# Altium project Hardware Design.PrjPcb (part 1 of 2)
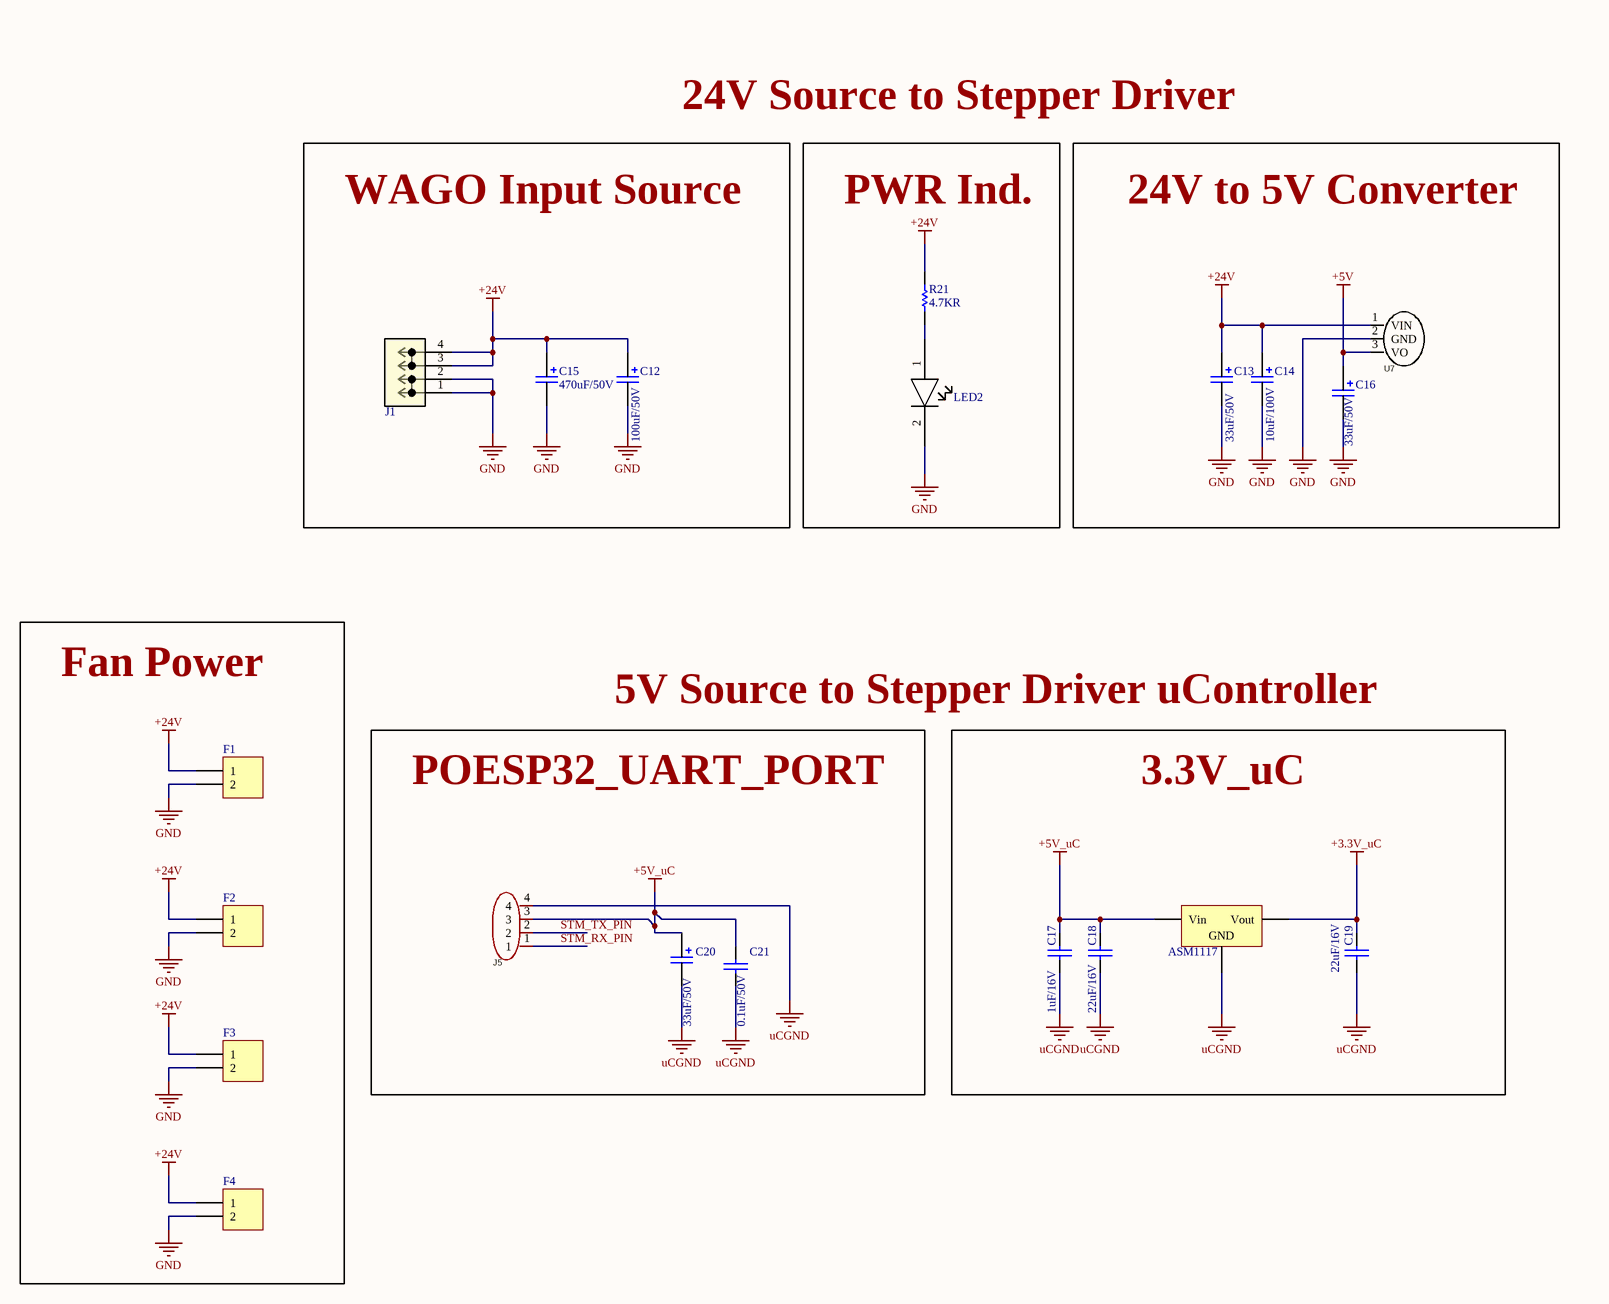
[diagram p0: POWER.SchDoc]
6 sheets, 222 parts. Net scope: global (net labels, ports and power ports of the same name join across sheets).
Board file: SystemV1.PcbDoc
Sheets:
  POWER.SchDoc
  STM.SchDoc
  Stepper Motor1.SchDoc
  Stepper Motor2.SchDoc
  Stepper Motor3.SchDoc
  Stepper Motor4.SchDoc

## Sheet POWER.SchDoc
size A2; SheetNumber: 2; SheetTotal: 7

### Parts
ASM1117  AMS1117 - 3.3V Reg  [SOT229P700X180-4N]  (value not drawn)
C12  100uF/50V  [CAPLEAD_D6.3mm]  (no BOM)
C13  33uF/50V  [CAPLEAD_D6.3mm]  (no BOM)
C14  10uF/100V  [CAPLEAD_D6.3mm]  (no BOM)
C15  470uF/50V  [CAPLEAD_D10mm]  (no BOM)
C16  33uF/50V  [CAPLEAD_D6.3mm]  (no BOM)
C17  1uF/16V  [PCBComponent_1]
C18  22uF/16V  [PCBComponent_1]
C19  22uF/16V  [PCBComponent_1]
C20  33uF/50V  [CAPLEAD_D6.3mm]  (no BOM)
C21  0.1uF/50V  [PCBComponent_1]
F1  (no value)  [PinHeader Polar]  (no BOM)
F2  (no value)  [PinHeader Polar]  (no BOM)
F3  (no value)  [PinHeader Polar]  (no BOM)
F4  (no value)  [PinHeader Polar]  (no BOM)
J1  Terminal Block  [CONN2_235-402331-000_WAGO]  (value not drawn)  (no BOM)
J5  Header 4P*2mm  [CONN-TH_4P-P2.00_HX20020-4A_2]  (value not drawn)  (no BOM)
LED2  1206 LED  [1206 LED]  (value not drawn)
R21  4.7KR  [R0402]
U7  C5369649  [SIP-3]  (value not drawn)  (no BOM)

### Blocks framed on the sheet
WAGO Input Source: C12 C15 J1
PWR Ind.: LED2 R21
24V to 5V Converter: C13 C14 C16 U7
Fan Power: F1-F4
POESP32_UART_PORT: C20 C21 J5
3.3V_uC: ASM1117 C17-C19

### Nets
+3.3V_uC: ASM1117.Vout C19.2
+5V: C16.1 U7.3(VO)
+5V_uC: ASM1117.Vin C17.2 C18.2 C20.1 C21.2 J5.3
+24V: C12.1 C13.1 C14.1 C15.1 F1.1 F2.1 F3.1 F4.1 J1.3(2_1) J1.4(2_2) R21.1 U7.1(VIN)
GND: C12.2 C13.2 C14.2 C15.2 C16.2 F1.2 F2.2 F3.2 F4.2 J1.1(1_1) J1.2(1_2) LED2.2 U7.2(GND)
uCGND: ASM1117.GND C17.1 C18.1 C19.1 C20.2 C21.1 J5.4
STM_RX_PIN: J5.1
STM_TX_PIN: J5.2
NetLED2_1: LED2.1 R21.2

### Notes on the sheet
- 24V Source to Stepper Driver
- 5V Source to Stepper Driver uController

### Library data of the parts
ASM1117 = AMS1117 - 3.3V Reg: C347222; Created By: NourAldin
C12 = A759EQ475M2AAAE160: C47891; Manufacturer: KEMET; Supplier 1: Mouser; Manufacturer Part Number: A759EQ475M2AAAE160; RoHS: Yes; Category: Polymer Capacitors; Stock 1: 17219; Pricing 1: 1=0.97, 10=0.73, 50=0.73, 100=0.546, 1000=0.384, 10000=0.326 (USD); ComponentLink1URL: http://www.kemet.com/docfinder?Partnumber=A759EQ475M2AAAE160&src-supplier=Digikey; ComponentLink1Description: http://www.kemet.com/docfinder?Partnumber=A759EQ475M2AAAE160&src-supplier=Digikey; ComponentLink2URL: http://www.farnell.com/datasheets/2095614.pdf?src-supplier=Element14; ComponentLink2Description: http://www.farnell.com/datasheets/2095614.pdf?src-supplier=Element14; Supplier Part Number 1: 80-A759EQ475M2AAE160
C13 C16 C20 = A759EQ475M2AAAE160: C45099; Manufacturer: KEMET; Supplier 1: Mouser; Manufacturer Part Number: A759EQ475M2AAAE160; RoHS: Yes; Category: Polymer Capacitors; Stock 1: 17219; Pricing 1: 1=0.97, 10=0.73, 50=0.73, 100=0.546, 1000=0.384, 10000=0.326 (USD); ComponentLink1URL: http://www.kemet.com/docfinder?Partnumber=A759EQ475M2AAAE160&src-supplier=Digikey; ComponentLink1Description: http://www.kemet.com/docfinder?Partnumber=A759EQ475M2AAAE160&src-supplier=Digikey; ComponentLink2URL: http://www.farnell.com/datasheets/2095614.pdf?src-supplier=Element14; ComponentLink2Description: http://www.farnell.com/datasheets/2095614.pdf?src-supplier=Element14; Supplier Part Number 1: 80-A759EQ475M2AAE160
C14 = A759EQ475M2AAAE160: C2029; Manufacturer: KEMET; Supplier 1: Mouser; Manufacturer Part Number: A759EQ475M2AAAE160; RoHS: Yes; Category: Polymer Capacitors; Stock 1: 17219; Pricing 1: 1=0.97, 10=0.73, 50=0.73, 100=0.546, 1000=0.384, 10000=0.326 (USD); ComponentLink1URL: http://www.kemet.com/docfinder?Partnumber=A759EQ475M2AAAE160&src-supplier=Digikey; ComponentLink1Description: http://www.kemet.com/docfinder?Partnumber=A759EQ475M2AAAE160&src-supplier=Digikey; ComponentLink2URL: http://www.farnell.com/datasheets/2095614.pdf?src-supplier=Element14; ComponentLink2Description: http://www.farnell.com/datasheets/2095614.pdf?src-supplier=Element14; Supplier Part Number 1: 80-A759EQ475M2AAE160
C15 = MAL215058101E3: C2960279; Manufacturer: Vishay BCcomponents; Manufacturer Part Number: MAL215058101E3; RoHS: Yes; Category: Aluminum Electrolytic Capacitors; Stock 1: 1562; Pricing 1: 1=1.45, 10=1.09, 50=1.09, 100=0.799, 1000=0.585, 10000=0.496 (USD); ComponentLink1URL: https://datasheet.ciiva.com/11697/150rmi-11697723.pdf?src-supplier=Avnet; ComponentLink1Description: https://datasheet.ciiva.com/11697/150rmi-11697723.pdf?src-supplier=Avnet; Supplier 1: Mouser; Supplier 2: LCSC; Supplier Part Number 2: C1596751; Supplier Part Number 1: 594-2222-150-58101
C17 = 0603 Capacitor: C1592; Created By: NourAldin; DataSheet Link: https://eu.mouser.com/datasheet/2/400/lcc_automotive_general_en-843974.pdf; Mouser Link: https://eu.mouser.com/ProductDetail/TDK/CGA1A2X7R1H331M030BA?qs=sGAEpiMZZMs0AnBnWHyRQL8L3bkL%252bvtyS9XpSB1mk7rVV5K8%252bbxEeg%3d%3d
C18 C19 = 0603 Capacitor: C2762594; Created By: NourAldin; DataSheet Link: https://eu.mouser.com/datasheet/2/400/lcc_automotive_general_en-843974.pdf; Mouser Link: https://eu.mouser.com/ProductDetail/TDK/CGA1A2X7R1H331M030BA?qs=sGAEpiMZZMs0AnBnWHyRQL8L3bkL%252bvtyS9XpSB1mk7rVV5K8%252bbxEeg%3d%3d
C21 = 0603 Capacitor: C1591; Created By: NourAldin; DataSheet Link: https://eu.mouser.com/datasheet/2/400/lcc_automotive_general_en-843974.pdf; Mouser Link: https://eu.mouser.com/ProductDetail/TDK/CGA1A2X7R1H331M030BA?qs=sGAEpiMZZMs0AnBnWHyRQL8L3bkL%252bvtyS9XpSB1mk7rVV5K8%252bbxEeg%3d%3d
F1-F4 = Header 2 pin: Created By: NourAldin
J1 = 235-402331-000: C7461083; Mfr_Name: Wago; RefDes: RefDes; Type: Type
J5 = ZX-HY2.0-4PZZ: C42372479; Manufacturer: Megastar(兆星); Add into BOM: yes; Pins Structure: 1x4P; Pitch: 2mm; Reference Series: HY; Number of PINs Per Row: 4; Current Rating (Max): 2A; Rated Voltage (Max): 250V; Flame Retardant Rating: UL94V-0; Z-Height of the Board: 8mm; X-Length of Bottom Edge on Board (Spacing Line): 10mm; Y-Width of Bottom Edge on Board: 5.1mm; Symbol: ZX-HY2.0-4PZZ; Device: ZX-HY2.0-4PZZ; LCSC Part Name: 1x4P 间距:2mm 直插 系列:HY 配套胶壳型号：ZX-HY2.0-4PJK 配套端子型号：ZX-HY2.0-DZ 配套杜邦线型号：ZX-HY2.0-4PBXC; Supplier Part: C7429580; Manufacturer Part: ZX-HY2.0-4PZZ; Supplier Footprint: 插件,P=2mm; JLCPCB Part Class: Extended Part; Datasheet: https://atta.szlcsc.com/upload/public/pdf/source/20241025/5A7CD93910E89EF197073334521200FC.pdf; Supplier: LCSC; Convert to PCB: yes; Mounting Style: Direct Insert; Number of Pins: 4P; Number of Rows: 1; Row Spacing: -; Contact Material: Brass; Contact Plating: Tin; Operating Temperature Range: -25℃~+85℃; Plastic Material: -; Supplementary Features: -; Colour: White
LED2 = 1206 LED: C434442; Created By: NourAldin
R21 = 0402 Resistor: C105871
U7 = K7805M-1000R3_C5369649: Manufacturer: YLPTEC(易川); Add into BOM: yes; Conversion Type: DC-DC; Function: Boost type; Input Voltage(DC): 7V~36V; Output Voltage: 5V; Output Power: 5W; Output Current (Max): 1000mA; Output Channel: 1; Conversion Efficiency: 94%; Maximum Capacitive Load: 2200uF; Symbol: K7805M-1000R3_C5369649; Device: K7805M-1000R3_C5369649; LCSC Part Name: K7805M-1000R3; Supplier Part: C5369649; Manufacturer Part: K7805M-1000R3; Supplier Footprint: SIP-3; JLCPCB Part Class: Extended Part; Datasheet: https://atta.szlcsc.com/upload/public/pdf/source/20230612/70568B8922D00E56BE7D7C892197C716.pdf; Supplier: LCSC; Convert to PCB: yes; Feature: Short-Circuit  Protection；Low-Power Consumption

## Sheet STM.SchDoc
size B; SheetNumber: 3; SheetTotal: 7
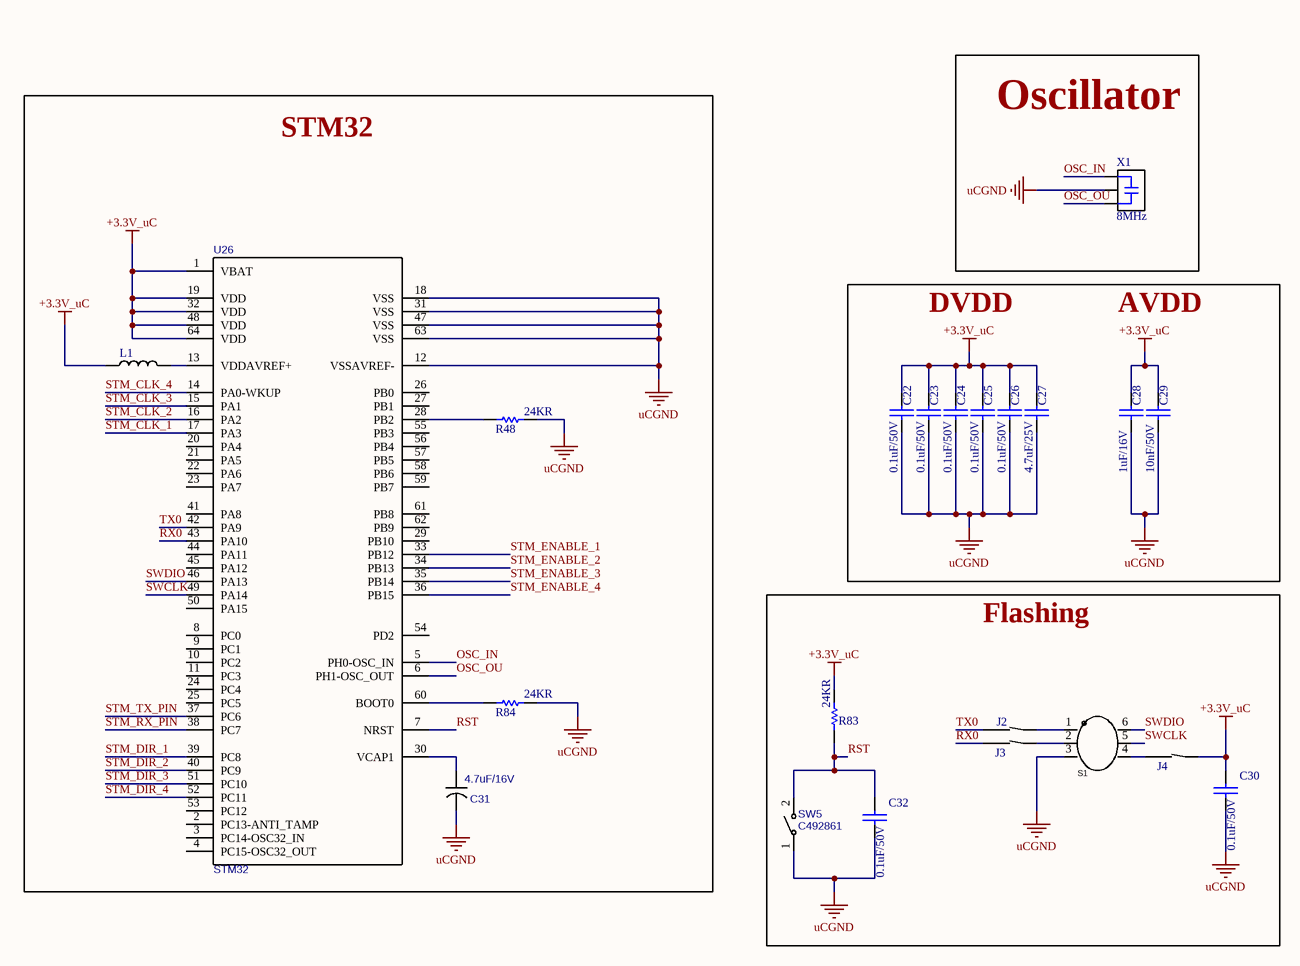
[diagram p1: STM.SchDoc]

### Parts
C22  0.1uF/50V  [PCBComponent_1]
C23  0.1uF/50V  [PCBComponent_1]
C24  0.1uF/50V  [PCBComponent_1]
C25  0.1uF/50V  [PCBComponent_1]
C26  0.1uF/50V  [PCBComponent_1]
C27  4.7uF/25V  [PCBComponent_1]
C28  1uF/16V  [PCBComponent_1]
C29  10nF/50V  [PCBComponent_1]
C30  0.1uF/50V  [PCBComponent_1]
C31  4.7uF/16V  [CASE-B_3528]
C32  0.1uF/50V  [PCBComponent_1]
J2  Jumper  [Jumper]  (value not drawn)  (no BOM)
J3  Jumper  [Jumper]  (value not drawn)  (no BOM)
J4  Jumper  [Jumper]  (value not drawn)  (no BOM)
L1  CMI201209X100KT  [INDC2012X06N]  (value not drawn)
R48  24KR  [RESC1608X06N]
R83  24KR  [RESC1608X06N]
R84  24KR  [RESC1608X06N]
S1  STM Debug  [STM_Debug]  (value not drawn)  (no BOM)
SW5  C492861  [SW-SMD_L4.0-W3.0-LS4.8]
U26  STM32  [LQFP-64_L10.0-W10.0-P0.50-LS12.0-BL]
X1  8MHz  [SMD3213-3P]

### Blocks framed on the sheet
Oscillator: X1
STM32: C31 L1 R48 R84 U26
Flashing: C30 C32 J2-J4 R83 S1 SW5

### Nets
+3.3V_uC: C22.2 C23.2 C24.2 C25.2 C26.2 C27.2 C28.2 C29.2 C30.2 J4.2 L1.1 R83.1 U26.1(VBAT) U26.19(VDD) U26.32(VDD) U26.48(VDD) U26.64(VDD)
uCGND: C22.1 C23.1 C24.1 C25.1 C26.1 C27.1 C28.1 C29.1 C30.1 C31.2 C32.1 R48.1 R84.1 S1.3 SW5.1 U26.12(VSSAVREF-) U26.18(VSS) U26.31(VSS) U26.47(VSS) U26.63(VSS) X1.2
OSC_IN: U26.5(PH0-OSC_IN) X1.1
OSC_OU: U26.6(PH1-OSC_OUT) X1.3
RST: C32.2 R83.2 SW5.2 U26.7(NRST)
RX0: J3.1 U26.43(PA10)
STM_CLK_1: U26.17(PA3)
STM_CLK_2: U26.16(PA2)
STM_CLK_3: U26.15(PA1)
STM_CLK_4: U26.14(PA0-WKUP)
STM_DIR_1: U26.39(PC8)
STM_DIR_2: U26.40(PC9)
STM_DIR_3: U26.51(PC10)
STM_DIR_4: U26.52(PC11)
STM_ENABLE_1: U26.33(PB12)
STM_ENABLE_2: U26.34(PB13)
STM_ENABLE_3: U26.35(PB14)
STM_ENABLE_4: U26.36(PB15)
STM_RX_PIN: U26.38(PC7)
STM_TX_PIN: U26.37(PC6)
SWCLK: S1.5 U26.49(PA14)
SWDIO: S1.6 U26.46(PA13)
TX0: J2.1 U26.42(PA9)
NetC31_1: C31.1 U26.30(VCAP1)
NetJ2_2: J2.2 S1.1
NetJ3_2: J3.2 S1.2
NetJ4_1: J4.1 S1.4
NetL1_2: L1.2 U26.13(VDDAVREF+)
NetR48_2: R48.2 U26.28(PB2)
NetR84_2: R84.2 U26.60(BOOT0)

Not connected (* = marked no-connect by the designer): U26 2(PC13-ANTI_TAMP) 3(PC14-OSC32_IN) 4(PC15-OSC32_OUT) 8(PC0) 9(PC1) 10(PC2) 11(PC3) 20(PA4) 21(PA5) 22(PA6) 23(PA7) 24(PC4) 25(PC5) 26(PB0) 27(PB1) 29(PB10) 41(PA8) 44(PA11) 45(PA12) 50(PA15) 53(PC12) 54(PD2) 55(PB3) 56(PB4) 57(PB5) 58(PB6) 59(PB7) 61(PB8) 62(PB9)

### Notes on the sheet
- DVDD
- AVDD

### Library data of the parts
C22-C26 C30 C32 = 0603 Capacitor: C1591; Created By: NourAldin; DataSheet Link: https://eu.mouser.com/datasheet/2/400/lcc_automotive_general_en-843974.pdf; Mouser Link: https://eu.mouser.com/ProductDetail/TDK/CGA1A2X7R1H331M030BA?qs=sGAEpiMZZMs0AnBnWHyRQL8L3bkL%252bvtyS9XpSB1mk7rVV5K8%252bbxEeg%3d%3d
C27 = 0603 Capacitor: C69335; Created By: NourAldin; DataSheet Link: https://eu.mouser.com/datasheet/2/400/lcc_automotive_general_en-843974.pdf; Mouser Link: https://eu.mouser.com/ProductDetail/TDK/CGA1A2X7R1H331M030BA?qs=sGAEpiMZZMs0AnBnWHyRQL8L3bkL%252bvtyS9XpSB1mk7rVV5K8%252bbxEeg%3d%3d
C28 = 0603 Capacitor: C1592; Created By: NourAldin; DataSheet Link: https://eu.mouser.com/datasheet/2/400/lcc_automotive_general_en-843974.pdf; Mouser Link: https://eu.mouser.com/ProductDetail/TDK/CGA1A2X7R1H331M030BA?qs=sGAEpiMZZMs0AnBnWHyRQL8L3bkL%252bvtyS9XpSB1mk7rVV5K8%252bbxEeg%3d%3d
C29 = 0603 Capacitor: C100042; Created By: NourAldin; DataSheet Link: https://eu.mouser.com/datasheet/2/400/lcc_automotive_general_en-843974.pdf; Mouser Link: https://eu.mouser.com/ProductDetail/TDK/CGA1A2X7R1H331M030BA?qs=sGAEpiMZZMs0AnBnWHyRQL8L3bkL%252bvtyS9XpSB1mk7rVV5K8%252bbxEeg%3d%3d
C31 = 3528  Tantalum Cap: C7206; Manufacturer: Kyocera AVX; Manufacturer Part: TAJR106K006RNJ; nameAlias: Value; Contributor: LCSC; Supplier: LCSC; Supplier Part: C132274; JLCPCB Part Class: Extended Part; spicePre: C; spiceSymbolName: TAJR106K006RNJ
L1 = 0805 SMD INDUCTOR: C99366; Created By: NourAldin
R48 R83 R84 = 0603 Resistor: C2930081; Created By: NourAldin; Mouser Link: https://eu.mouser.com/ProductDetail/Panasonic/ERA-3AHD180V?qs=sGAEpiMZZMvdGkrng054t5mej2KPdPuFSlDBd1tSiF0%3d; DataSheet Link: https://eu.mouser.com/datasheet/2/315/AOA0000C307-1149632.pdf
S1 = STM Debug: Wurth Elektronik 490107670612; Manufacturer: XKB Connection(中国星坤); Symbol: X4621WVS-2X03I-C40D64; Add into BOM: yes; Pin Structure: 2x3P; Pitch: 2mm; Circluar Pins/Square Pins: Square Pins; Current Rating (Max): 2A; Voltage Rating (Max): 250V; Soldering Temperature(Max): 260℃; Device: X4621WVS-2x03I-C40D64; LCSC Part Name: 2x3P 间距:2mm 方针 直插; Supplier Part: C917608; Manufacturer Part: X4621WVS-2x03I-C40D64; Supplier Footprint: SMD,P=2mm; JLCPCB Part Class: Extended Part; Datasheet: https://atta.szlcsc.com/upload/public/pdf/source/20211011/BBC0D112400A54BA7413419DECD38CC2.pdf; Supplier: LCSC; Convert to PCB: yes; Row Spacing: 2mm; Mounting Type: Straight; Number of Rows: 双排; Number of Pins: 6P; Length of Mating Pin: 4mm; Insulation Height: 2mm; Length of End Connection Pin: 6.4mm; Contact Plating: Gold; Operating Temperature Range: -40℃~+105℃; Color: Black
SW5 = tact switch: Manufacturer: Yuandi(元迪); Manufacturer Part: TS-1071AS-A1B3-D4; Contributor: LCSC; Supplier: LCSC; Supplier Part: C492861; JLCPCB Part Class: Extended Part; spicePre: S; spiceSymbolName: TS-1071AS-A1B3-D4
U26 = STM32F401RCT6: C74524; Manufacturer: ST(意法半导体); Supplier: LCSC; Manufacturer Part: STM32F401RCT6; Supplier Part: C74524; JLCPCB Part Class: Extended Part; spicePre: U; spiceSymbolName: STM32F401RCT6
X1 = CSTCE16M0V53-R0: C907975; Manufacturer: Murata; Frequency: 16MHz; Frequency Stability: 0.3%; Frequency Tolerance: 0.5%; Capacitance: 15pF; Impedance: 40R; Supplier 1: Digi-Key; Manufacturer Part Number: CSTCE16M0V53-R0; RoHS: Yes; Category: Resonators; Mount: Surface Mount; Case/Package: SMD/SMT; Min Operating Temperature: -40°C; Max Operating Temperature: 85°C; Packaging: Cut Tape; Series: CERALOCK® CSTNE; RoHS Compliant: Yes; ComponentLink1URL: https://www.murata.com/en/products/productdata/8801162231838/SPEC-CSTNE16M0V530000R0.pdf?src-supplier=Digi-Key; ComponentLink1Description: https://www.murata.com/en/products/productdata/8801162231838/SPEC-CSTNE16M0V530000R0.pdf?src-supplier=Digi-Key; LCSC Link: https://www.lcsc.com/product-detail/Ceramic-Resonators_Murata-Electronics-CSTCE16M0V53-R0_C32180.html; Supplier Part Number 1: 490-1198-2-ND; Supplier Part Number 2: C32180

## Sheet Stepper Motor1.SchDoc
size A2; SheetNumber: 4; SheetTotal: 7
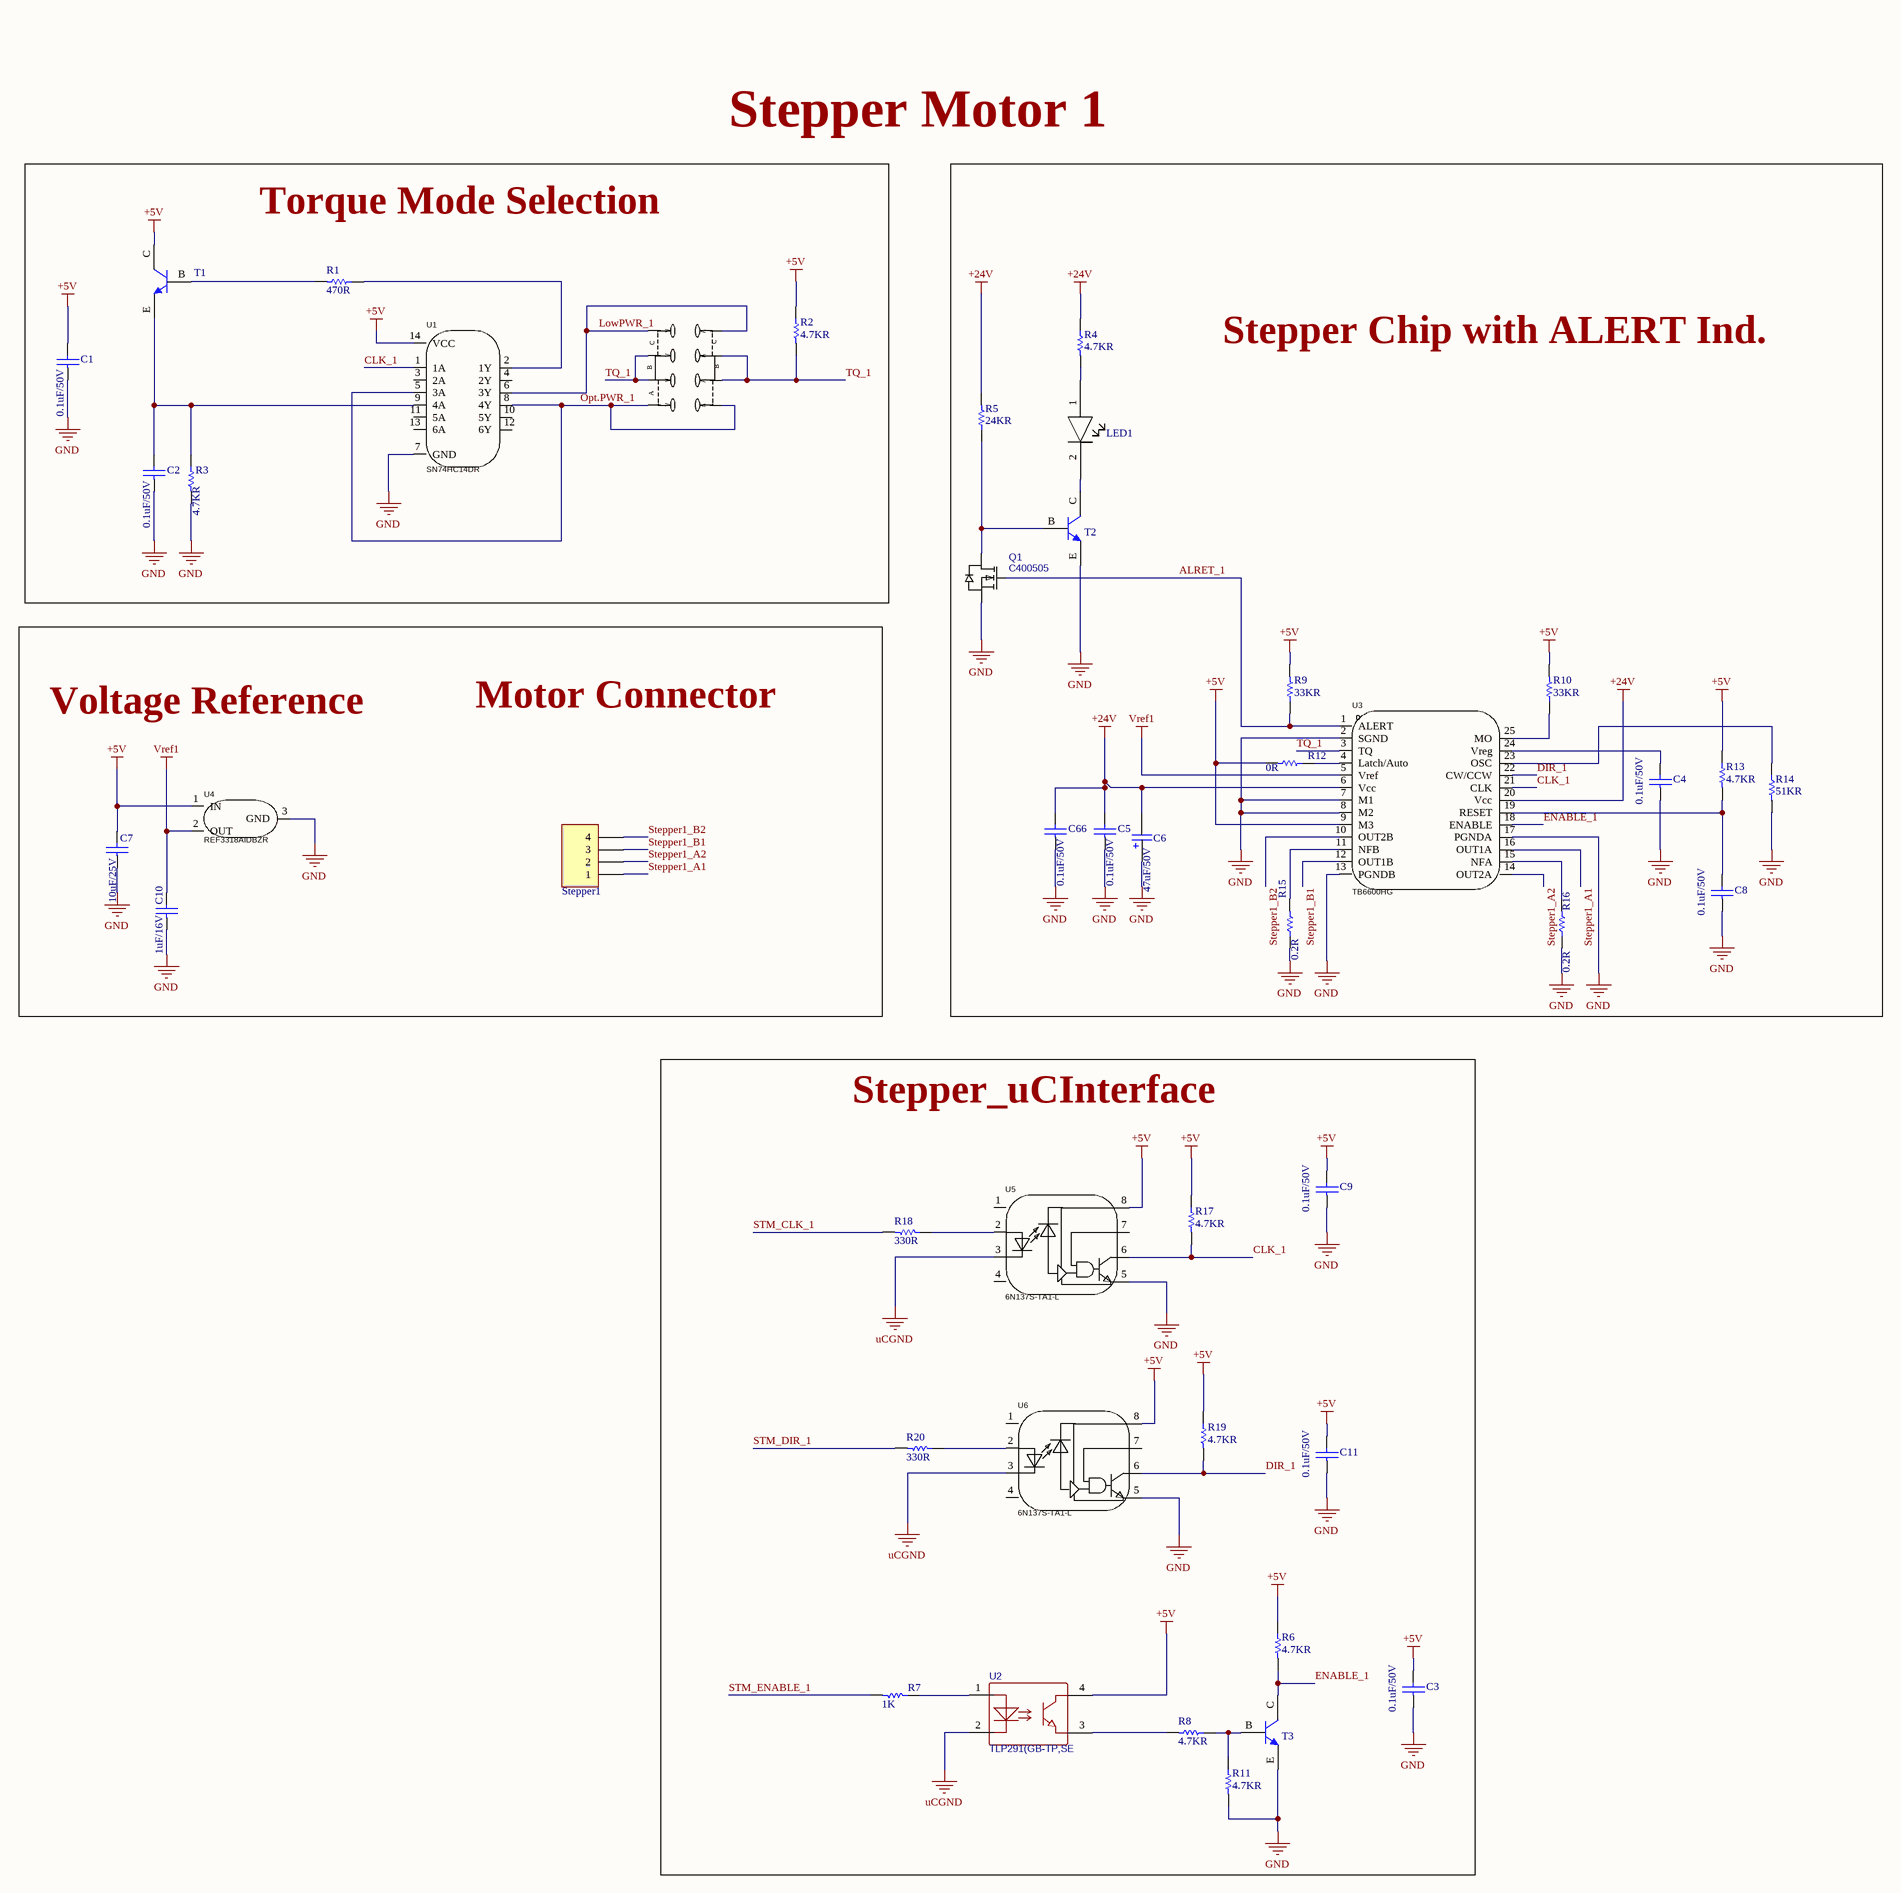
[diagram p2: Stepper Motor1.SchDoc]

### Parts
C1  0.1uF/50V  [PCBComponent_1]
C2  0.1uF/50V  [PCBComponent_1]
C3  0.1uF/50V  [PCBComponent_1]
C4  0.1uF/50V  [PCBComponent_1]
C5  0.1uF/50V  [PCBComponent_1]
C6  47uF/50V  [CAPLEAD_D6.3mm]  (no BOM)
C7  10uF/25V  [PCBComponent_1]
C8  0.1uF/50V  [PCBComponent_1]
C9  0.1uF/50V  [PCBComponent_1]
C10  1uF/16V  [PCBComponent_1]
C11  0.1uF/50V  [PCBComponent_1]
C66  0.1uF/50V  [PCBComponent_1]
LED1  1206 LED  [1206 LED]  (value not drawn)
Q1  C400505  [SOT-23-3_L2.9-W1.3-P1.90-LS2.4-BR]
R1  470R  [RESC1608X06N]
R2  4.7KR  [R0402]
R3  4.7KR  [R0402]
R4  4.7KR  [R0402]
R5  24KR  [RESC1608X06N]
R6  4.7KR  [R0402]
R7  1K  [R0402]
R8  4.7KR  [R0402]
R9  33KR  [RESC1608X06N]
R10  33KR  [RESC1608X06N]
R11  4.7KR  [R0402]
R12  0R  [RESC1608X06N]
R13  4.7KR  [R0402]
R14  51KR  [R0402]
R15  0.2R  [RESC6431X12N]
R16  0.2R  [RESC6431X12N]
R17  4.7KR  [R0402]
R18  330R  [R0402]
R19  4.7KR  [R0402]
R20  330R  [R0402]
Stepper1  Header 4 Pin Polar  [PCBComponent_1]  (value not drawn)  (no BOM)
SW1  MST23D19G2  [SW-SMD_MST23D19G2]  (value not drawn)
T1  MMBT3904 Transistor  [MMBT3904]  (value not drawn)
T2  MMBT3904 Transistor  [MMBT3904]  (value not drawn)
T3  MMBT3904 Transistor  [MMBT3904]  (value not drawn)
U1  SN74HC14DR  [SOIC-14_L8.7-W3.9-P1.27-LS6.0-BL]
U2  TLP291(GB-TP,SE  [SOP-4-1.27mm]
U3  TB6600HG  [HZIP25-P-1.00F]  (no BOM)
U4  REF3318AIDBZR  [SOT-23-3_L2.9-W1.3-P1.90-LS2.4-BR]
U5  6N137S-TA1-L  [SOP-8_L9.8-W6.6-P2.54-LS10.3-BL]
U6  6N137S-TA1-L  [SOP-8_L9.8-W6.6-P2.54-LS10.3-BL]

### Blocks framed on the sheet
Torque Mode Selection: C1 C2 R1-R3 SW1 T1 U1
Stepper Chip with ALERT Ind.: C4-C6 C8 C66 LED1 Q1 R4 R5 R9 R10 R12-R16 T2 U3
Stepper_uCInterface: C3 C9 C11 R6-R8 R11 R17-R20 T3 U2 U5 U6

### Nets
+5V: C1.2 C3.2 C7.2 C9.2 C11.2 R2.1 R6.1 R9.2 R10.2 R12.2 R13.1 R17.1 R19.1 T1.C U1.14(VCC) U2.4 U3.9(M3) U4.1(IN) U5.8 U6.8
+24V: C5.2 C6.2 C66.2 R4.1 R5.2 U3.6(Vcc) U3.20(Vcc)
GND: C1.1 C2.1 C3.1 C4.1 C5.1 C6.1 C7.1 C8.1 C9.1 C10.1 C11.1 C66.1 Q1.2(S) R3.2 R11.2 R14.2 R15.1 R16.1 T2.E T3.E U1.7(GND) U3.2(SGND) U3.7(M1) U3.8(M2) U3.13(PGNDB) U3.17(PGNDA) U4.3(GND) U5.5 U6.5
uCGND: U2.2 U5.3 U6.3
Vref1: C10.2 U3.5(Vref) U4.2(OUT)
ALRET_1: Q1.1(G) R9.1 U3.1(ALERT)
CLK_1: R17.2 U1.1(1A) U3.21(CLK) U5.6
DIR_1: R19.2 U3.22(CW/CCW) U6.6
ENABLE_1: R6.2 T3.C U3.18(ENABLE)
LowPWR_1: SW1.4 SW1.5 U1.6(3Y)
Opt.PWR_1: SW1.1 SW1.8 U1.5(3A) U1.8(4Y)
Stepper1_A1: Stepper1.1 U3.16(OUT1A)
Stepper1_A2: Stepper1.2 U3.14(OUT2A)
Stepper1_B1: Stepper1.3 U3.12(OUT1B)
Stepper1_B2: Stepper1.4 U3.10(OUT2B)
STM_CLK_1: R18.2
STM_DIR_1: R20.2
STM_ENABLE_1: R7.2
TQ_1: R2.2 SW1.2 SW1.3 SW1.6 SW1.7 U3.3(TQ)
NetC2_2: C2.2 R3.1 T1.E U1.9(4A)
NetC4_2: C4.2 U3.24(Vreg)
NetC8_2: C8.2 R13.2 U3.19(RESET)
NetLED1_1: LED1.1 R4.2
NetLED1_2: LED1.2 T2.C
NetQ1_3: Q1.3(D) R5.1 T2.B
NetR1_1: R1.1 U1.2(1Y)
NetR1_2: R1.2 T1.B
NetR7_1: R7.1 U2.1
NetR8_1: R8.1 R11.1 T3.B
NetR8_2: R8.2 U2.3
NetR10_1: R10.1 U3.25(MO)
NetR12_1: R12.1 U3.4(Latch/Auto)
NetR14_1: R14.1 U3.23(OSC)
NetR15_2: R15.2 U3.11(NFB)
NetR16_2: R16.2 U3.15(NFA)
NetR18_1: R18.1 U5.2
NetR20_1: R20.1 U6.2

Not connected (* = marked no-connect by the designer): U1 3(2A) 4(2Y) 10(5Y) 11(5A) 12(6Y) 13(6A); U5 1(NC) 4(NC) 7; U6 1(NC) 4(NC) 7

### Notes on the sheet
- Stepper Motor 1
- Voltage Reference
- Motor Connector
- (in symbol MST23D19G2) C; B; A

### Library data of the parts
C1-C5 C8 C9 C11 C66 = 0603 Capacitor: C1591; Created By: NourAldin; DataSheet Link: https://eu.mouser.com/datasheet/2/400/lcc_automotive_general_en-843974.pdf; Mouser Link: https://eu.mouser.com/ProductDetail/TDK/CGA1A2X7R1H331M030BA?qs=sGAEpiMZZMs0AnBnWHyRQL8L3bkL%252bvtyS9XpSB1mk7rVV5K8%252bbxEeg%3d%3d
C6 = A759EQ475M2AAAE160: C45100; Manufacturer: KEMET; Supplier 1: Mouser; Manufacturer Part Number: A759EQ475M2AAAE160; RoHS: Yes; Category: Polymer Capacitors; Stock 1: 17219; Pricing 1: 1=0.97, 10=0.73, 50=0.73, 100=0.546, 1000=0.384, 10000=0.326 (USD); ComponentLink1URL: http://www.kemet.com/docfinder?Partnumber=A759EQ475M2AAAE160&src-supplier=Digikey; ComponentLink1Description: http://www.kemet.com/docfinder?Partnumber=A759EQ475M2AAAE160&src-supplier=Digikey; ComponentLink2URL: http://www.farnell.com/datasheets/2095614.pdf?src-supplier=Element14; ComponentLink2Description: http://www.farnell.com/datasheets/2095614.pdf?src-supplier=Element14; Supplier Part Number 1: 80-A759EQ475M2AAE160
C7 = 0603 Capacitor: C96446; Created By: NourAldin; DataSheet Link: https://eu.mouser.com/datasheet/2/400/lcc_automotive_general_en-843974.pdf; Mouser Link: https://eu.mouser.com/ProductDetail/TDK/CGA1A2X7R1H331M030BA?qs=sGAEpiMZZMs0AnBnWHyRQL8L3bkL%252bvtyS9XpSB1mk7rVV5K8%252bbxEeg%3d%3d
C10 = 0603 Capacitor: C1592; Created By: NourAldin; DataSheet Link: https://eu.mouser.com/datasheet/2/400/lcc_automotive_general_en-843974.pdf; Mouser Link: https://eu.mouser.com/ProductDetail/TDK/CGA1A2X7R1H331M030BA?qs=sGAEpiMZZMs0AnBnWHyRQL8L3bkL%252bvtyS9XpSB1mk7rVV5K8%252bbxEeg%3d%3d
LED1 = 1206 LED: C434438; Created By: NourAldin
Q1 = BSS138_MOSFET: Manufacturer: YANGJIE(扬杰); Manufacturer Part: BSS138; Contributor: LCSC; Supplier: LCSC; Supplier Part: C400505; JLCPCB Part Class: Extended Part; spicePre: Q; spiceSymbolName: BSS138_C400505
R1 = 0603 Resistor: C114669; Created By: NourAldin; Mouser Link: https://eu.mouser.com/ProductDetail/Panasonic/ERA-3AHD180V?qs=sGAEpiMZZMvdGkrng054t5mej2KPdPuFSlDBd1tSiF0%3d; DataSheet Link: https://eu.mouser.com/datasheet/2/315/AOA0000C307-1149632.pdf
R2-R4 R6 R8 R11 R13 R17 R19 = 0402 Resistor: C105871
R5 = 0603 Resistor: C2930081; Created By: NourAldin; Mouser Link: https://eu.mouser.com/ProductDetail/Panasonic/ERA-3AHD180V?qs=sGAEpiMZZMvdGkrng054t5mej2KPdPuFSlDBd1tSiF0%3d; DataSheet Link: https://eu.mouser.com/datasheet/2/315/AOA0000C307-1149632.pdf
R7 = 0402 Resistor: C106235
R9 R10 = 0603 Resistor: C126359; Created By: NourAldin; Mouser Link: https://eu.mouser.com/ProductDetail/Panasonic/ERA-3AHD180V?qs=sGAEpiMZZMvdGkrng054t5mej2KPdPuFSlDBd1tSiF0%3d; DataSheet Link: https://eu.mouser.com/datasheet/2/315/AOA0000C307-1149632.pdf
R12 = 0603 Resistor: C100044; Created By: NourAldin; Mouser Link: https://eu.mouser.com/ProductDetail/Panasonic/ERA-3AHD180V?qs=sGAEpiMZZMvdGkrng054t5mej2KPdPuFSlDBd1tSiF0%3d; DataSheet Link: https://eu.mouser.com/datasheet/2/315/AOA0000C307-1149632.pdf
R14 = 0402 Resistor: C107230
R15 R16 = 2512 Resistor: C2903473; Created By: NourAldin; Mouser Link: https://eu.mouser.com/ProductDetail/Bourns/CSS2H-2512K-2L00F?qs=sGAEpiMZZMukHu%252bjC5l7YewuupLM8jZrvWs15Y6t0rY%3D&fbclid=IwAR0ZD_uc1Y03YG_KyYG8NxrpBzYgFzVeevvjxrlqtGWJ1HKz-jrYfqlFWCw; DataSheet Link: https://eu.mouser.com/datasheet/2/54/ss2h-2512-1302652.pdf
R18 R20 = 0402 Resistor: C105875
SW1 = MST23D19G2: C431545; Manufacturer: SHOU HAN(首韩); Add into BOM: yes; Circuit: 双刀三掷; Pin Style: SMDSplicing; Switch Length: 12.95mm; Switch Width: 3.55mm; Switch Height: 3.5mm; Current Rating (DC): 100mA; Voltage Rating (DC): 12V; Mechanical Life: 1万次; Symbol: MST23D19G2; Device: MST23D19G2; LCSC Part Name: 三档立式贴片 8脚拨动 柄长2.0MM; Supplier Part: C431545; Manufacturer Part: MST23D19G2; Supplier Footprint: SMD; JLCPCB Part Class: Extended Part; Datasheet: https://atta.szlcsc.com/upload/public/pdf/source/20190925/C431545_A88710AC241B275593C257CF6D595AD7.pdf; Supplier: LCSC; Convert to PCB: yes; Actuator Style: -; Mounting Style: Brick nogging; Actuator Color: -; Current Rating (AC): -; Voltage Rating (AC): -; Operating Temperature: -25℃~+70℃
T1-T3 = MMBT3904 Transistor: C108429; Created By: NourAldin
U1 = SN74HC14DR: C6820; Manufacturer: TI(德州仪器); Add into BOM: yes; Input Type: Schmitt Trigger; Supply Voltage(Single): 2V~6V; Supply Current (Max): 2uA; Number of Circuits: 6; Number of Inputs: 1; Sink Current: 5.2mA; High level range (VIH): 1.5V~4.2V; Low level range (VIL): 300mV~1.2V; Max Propagation Delay: 21ns@6V,50pF; Symbol: SN74HC14DR; Device: SN74HC14DR; LCSC Part Name: 六路施密特触发反相器; Supplier Part: C6820; Manufacturer Part: SN74HC14DR; Supplier Footprint: SOIC-14; JLCPCB Part Class: Extended Part; Datasheet: https://www.ti.com/cn/lit/gpn/sn74hc14; Supplier: LCSC; Convert to PCB: yes; Source Current: 5.2mA; Series: 74HCSeries; Operating Temperature: -40℃~+85℃
U2 = TLP291(GB-TP,SE(T: C55144; BOM_Manufacturer: TOSHIBA(东芝); BOM_Supplier: LCSC; Manufacturer Part Number: TLP291(GB-TP,SE; Supplier Part Number 2: C55144; BOM_JLCPCB Part Class: Extended Part; LCSC Link: https://www.lcsc.com/product-detail/Optocouplers-Phototransistor-Output_TOSHIBA-TLP291-GB-TP-SE_C55144.html; spiceSymbolName: TLP291(GB-TP,SE(T
U3 = TB6600HG: C66042; Manufacturer: TOSHIBA(东芝); Add into BOM: yes; Symbol: TB6600HG; Device: TB6600HG; LCSC Part Name: 4.5A 42V电机驱动芯片; Supplier Part: C66042; Manufacturer Part: TB6600HG; Supplier Footprint: HZIP-25-P-1mm; JLCPCB Part Class: Extended Part; Datasheet: https://atta.szlcsc.com/upload/public/pdf/source/20170511/1494500127812.pdf; Supplier: LCSC; Convert to PCB: yes
U4 = REF3318AIDBZR: C115877; Manufacturer: TI(德州仪器); Add into BOM: yes; Output Type: Fixed; Input Voltage: 2V~5.5V; Output Voltage: 1.8V; Output Current: 5mA; Tolerance: ±0.15%; Temperature Coefficient: 30ppm/℃; Reference Type: series connection; Supply Current: 8.5uA; Noise - 1/10Hz to 10Hz: 50uVp-p; Symbol: REF3318AIDBZR; Device: REF3318AIDBZR; LCSC Part Name: REF3318AIDBZR; Supplier Part: C115877; Manufacturer Part: REF3318AIDBZR; Supplier Footprint: SOT-23; JLCPCB Part Class: Extended Part; Datasheet: https://www.ti.com/cn/lit/gpn/ref3318; Supplier: LCSC; Convert to PCB: yes; Noise - 10Hz to 10kHz: -; Operating Temperature: -40℃~+125℃@(Ta)
U5 U6 = 6N137S-TA1-L: C92651; Manufacturer: LITEON(光宝); Add into BOM: yes; Input Type: DC; Supply Voltage: 4.5V~5.5V; Common Mode Transient Immunity (CMTI): 10kV/us; Data Rate: 15Mbit/s; Propagation Delay tpLH/tpHL: 32ns；40ns; Number of Channels: 1; Symbol: 6N137S-TA1; Device: 6N137S-TA1-L; LCSC Part Name: DC输入 1通道; Supplier Part: C92651; Manufacturer Part: 6N137S-TA1-L; Supplier Footprint: SOP-8-2.54mm; JLCPCB Part Class: Extended Part; Datasheet: https://atta.szlcsc.com/upload/public/pdf/source/20191018/C92651_D1F9F6F1F10C7EC7C3739E5ECB700036.pdf; Supplier: LCSC; Convert to PCB: yes; Operating Temperature: -40℃~+85℃

## Sheet Stepper Motor2.SchDoc
size A2; SheetNumber: 5; SheetTotal: 7
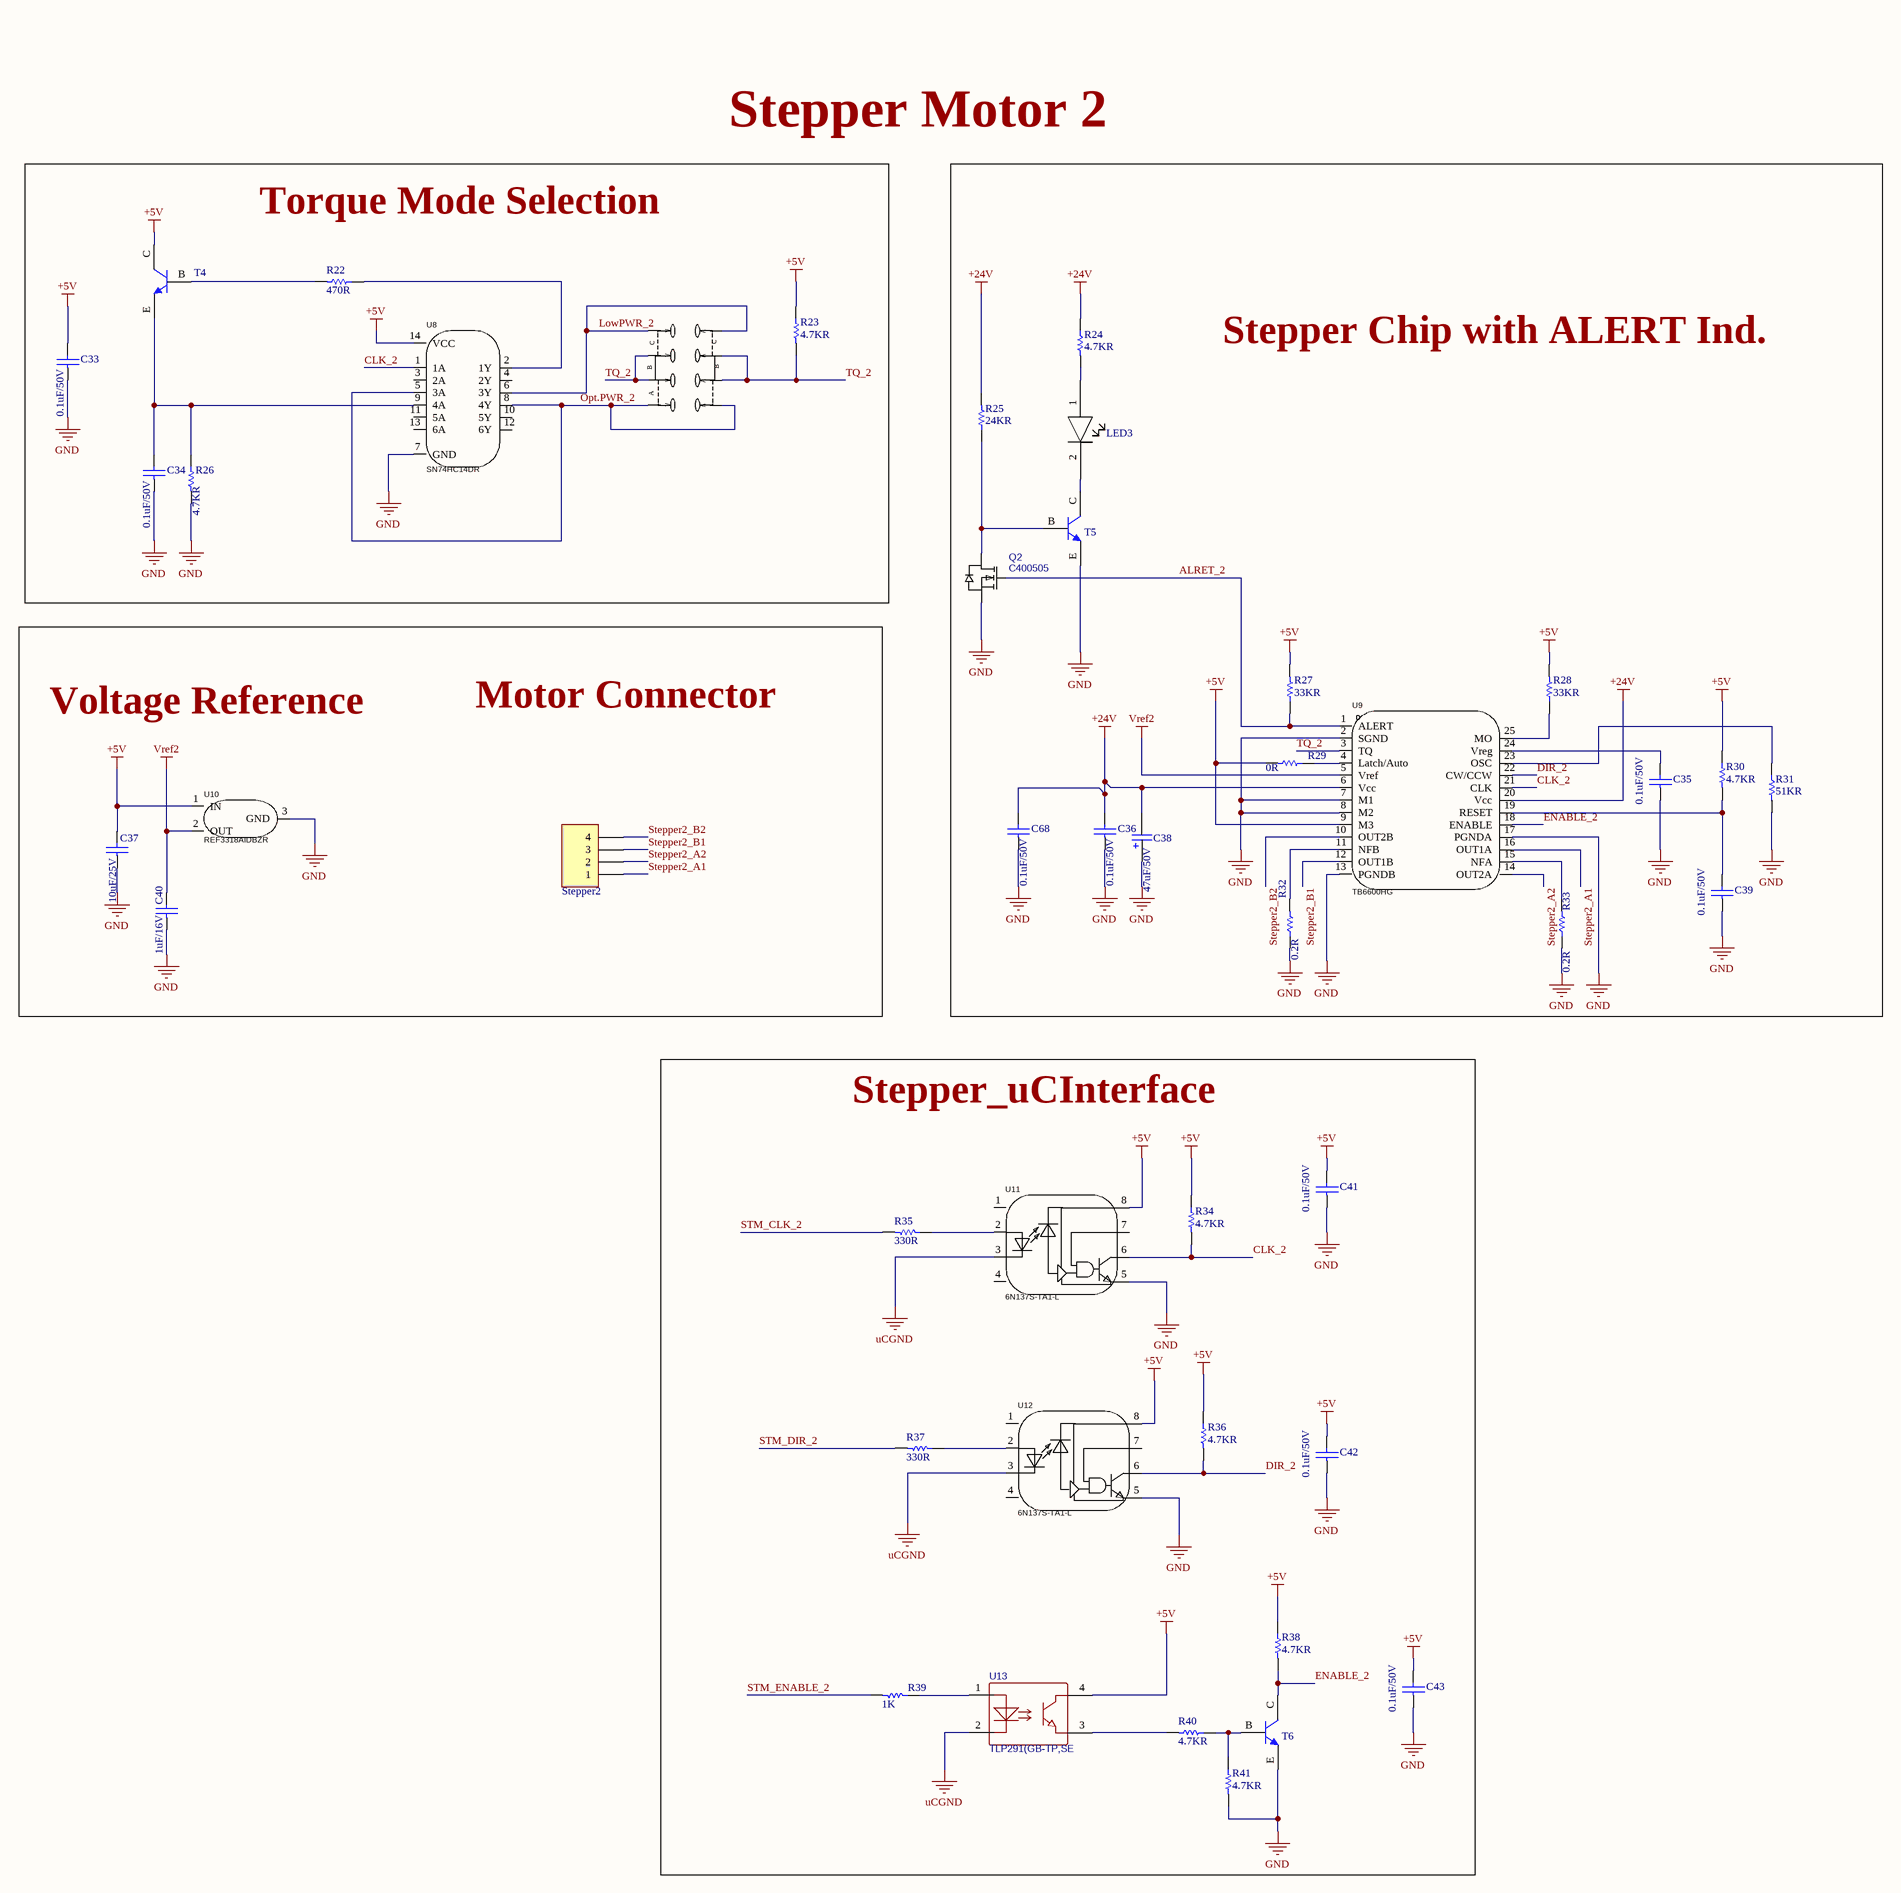
[diagram p3: Stepper Motor2.SchDoc]

### Parts
C33  0.1uF/50V  [PCBComponent_1]
C34  0.1uF/50V  [PCBComponent_1]
C35  0.1uF/50V  [PCBComponent_1]
C36  0.1uF/50V  [PCBComponent_1]
C37  10uF/25V  [PCBComponent_1]
C38  47uF/50V  [CAPLEAD_D6.3mm]  (no BOM)
C39  0.1uF/50V  [PCBComponent_1]
C40  1uF/16V  [PCBComponent_1]
C41  0.1uF/50V  [PCBComponent_1]
C42  0.1uF/50V  [PCBComponent_1]
C43  0.1uF/50V  [PCBComponent_1]
C68  0.1uF/50V  [PCBComponent_1]
LED3  1206 LED  [1206 LED]  (value not drawn)
Q2  C400505  [SOT-23-3_L2.9-W1.3-P1.90-LS2.4-BR]
R22  470R  [RESC1608X06N]
R23  4.7KR  [R0402]
R24  4.7KR  [R0402]
R25  24KR  [RESC1608X06N]
R26  4.7KR  [R0402]
R27  33KR  [RESC1608X06N]
R28  33KR  [RESC1608X06N]
R29  0R  [RESC1608X06N]
R30  4.7KR  [R0402]
R31  51KR  [R0402]
R32  0.2R  [RESC6431X12N]
R33  0.2R  [RESC6431X12N]
R34  4.7KR  [R0402]
R35  330R  [R0402]
R36  4.7KR  [R0402]
R37  330R  [R0402]
R38  4.7KR  [R0402]
R39  1K  [R0402]
R40  4.7KR  [R0402]
R41  4.7KR  [R0402]
Stepper2  Header 4 Pin Polar  [PCBComponent_1]  (value not drawn)  (no BOM)
SW2  MST23D19G2  [SW-SMD_MST23D19G2]  (value not drawn)
T4  MMBT3904 Transistor  [MMBT3904]  (value not drawn)
T5  MMBT3904 Transistor  [MMBT3904]  (value not drawn)
T6  MMBT3904 Transistor  [MMBT3904]  (value not drawn)
U8  SN74HC14DR  [SOIC-14_L8.7-W3.9-P1.27-LS6.0-BL]
U9  TB6600HG  [HZIP25-P-1.00F]  (no BOM)
U10  REF3318AIDBZR  [SOT-23-3_L2.9-W1.3-P1.90-LS2.4-BR]
U11  6N137S-TA1-L  [SOP-8_L9.8-W6.6-P2.54-LS10.3-BL]
U12  6N137S-TA1-L  [SOP-8_L9.8-W6.6-P2.54-LS10.3-BL]
U13  TLP291(GB-TP,SE  [SOP-4-1.27mm]

### Blocks framed on the sheet
Torque Mode Selection: C33 C34 R22 R23 R26 SW2 T4 U8
Stepper Chip with ALERT Ind.: C35 C36 C38 C39 C68 LED3 Q2 R24 R25 R27-R33 T5 U9
Stepper_uCInterface: C41-C43 R34-R41 T6 U11-U13

### Nets
+5V: C33.2 C37.2 C41.2 C42.2 C43.2 R23.1 R27.2 R28.2 R29.2 R30.1 R34.1 R36.1 R38.1 T4.C U8.14(VCC) U9.9(M3) U10.1(IN) U11.8 U12.8 U13.4
+24V: C36.2 C38.2 C68.2 R24.1 R25.2 U9.6(Vcc) U9.20(Vcc)
GND: C33.1 C34.1 C35.1 C36.1 C37.1 C38.1 C39.1 C40.1 C41.1 C42.1 C43.1 C68.1 Q2.2(S) R26.2 R31.2 R32.1 R33.1 R41.2 T5.E T6.E U8.7(GND) U9.2(SGND) U9.7(M1) U9.8(M2) U9.13(PGNDB) U9.17(PGNDA) U10.3(GND) U11.5 U12.5
uCGND: U11.3 U12.3 U13.2
Vref2: C40.2 U9.5(Vref) U10.2(OUT)
ALRET_2: Q2.1(G) R27.1 U9.1(ALERT)
CLK_2: R34.2 U8.1(1A) U9.21(CLK) U11.6
DIR_2: R36.2 U9.22(CW/CCW) U12.6
ENABLE_2: R38.2 T6.C U9.18(ENABLE)
LowPWR_2: SW2.4 SW2.5 U8.6(3Y)
Opt.PWR_2: SW2.1 SW2.8 U8.5(3A) U8.8(4Y)
Stepper2_A1: Stepper2.1 U9.16(OUT1A)
Stepper2_A2: Stepper2.2 U9.14(OUT2A)
Stepper2_B1: Stepper2.3 U9.12(OUT1B)
Stepper2_B2: Stepper2.4 U9.10(OUT2B)
STM_CLK_2: R35.2
STM_DIR_2: R37.2
STM_ENABLE_2: R39.2
TQ_2: R23.2 SW2.2 SW2.3 SW2.6 SW2.7 U9.3(TQ)
NetC34_2: C34.2 R26.1 T4.E U8.9(4A)
NetC35_2: C35.2 U9.24(Vreg)
NetC39_2: C39.2 R30.2 U9.19(RESET)
NetLED3_1: LED3.1 R24.2
NetLED3_2: LED3.2 T5.C
NetQ2_3: Q2.3(D) R25.1 T5.B
NetR22_1: R22.1 U8.2(1Y)
NetR22_2: R22.2 T4.B
NetR28_1: R28.1 U9.25(MO)
NetR29_1: R29.1 U9.4(Latch/Auto)
NetR31_1: R31.1 U9.23(OSC)
NetR32_2: R32.2 U9.11(NFB)
NetR33_2: R33.2 U9.15(NFA)
NetR35_1: R35.1 U11.2
NetR37_1: R37.1 U12.2
NetR39_1: R39.1 U13.1
NetR40_1: R40.1 R41.1 T6.B
NetR40_2: R40.2 U13.3

Not connected (* = marked no-connect by the designer): U8 3(2A) 4(2Y) 10(5Y) 11(5A) 12(6Y) 13(6A); U11 1(NC) 4(NC) 7; U12 1(NC) 4(NC) 7

### Notes on the sheet
- Stepper Motor 2
- Voltage Reference
- Motor Connector
- (in symbol MST23D19G2) C; B; A

### Library data of the parts
C33-C36 C39 C41-C43 C68 = 0603 Capacitor: C1591; Created By: NourAldin; DataSheet Link: https://eu.mouser.com/datasheet/2/400/lcc_automotive_general_en-843974.pdf; Mouser Link: https://eu.mouser.com/ProductDetail/TDK/CGA1A2X7R1H331M030BA?qs=sGAEpiMZZMs0AnBnWHyRQL8L3bkL%252bvtyS9XpSB1mk7rVV5K8%252bbxEeg%3d%3d
C37 = 0603 Capacitor: C96446; Created By: NourAldin; DataSheet Link: https://eu.mouser.com/datasheet/2/400/lcc_automotive_general_en-843974.pdf; Mouser Link: https://eu.mouser.com/ProductDetail/TDK/CGA1A2X7R1H331M030BA?qs=sGAEpiMZZMs0AnBnWHyRQL8L3bkL%252bvtyS9XpSB1mk7rVV5K8%252bbxEeg%3d%3d
C38 = A759EQ475M2AAAE160: C45100; Manufacturer: KEMET; Supplier 1: Mouser; Manufacturer Part Number: A759EQ475M2AAAE160; RoHS: Yes; Category: Polymer Capacitors; Stock 1: 17219; Pricing 1: 1=0.97, 10=0.73, 50=0.73, 100=0.546, 1000=0.384, 10000=0.326 (USD); ComponentLink1URL: http://www.kemet.com/docfinder?Partnumber=A759EQ475M2AAAE160&src-supplier=Digikey; ComponentLink1Description: http://www.kemet.com/docfinder?Partnumber=A759EQ475M2AAAE160&src-supplier=Digikey; ComponentLink2URL: http://www.farnell.com/datasheets/2095614.pdf?src-supplier=Element14; ComponentLink2Description: http://www.farnell.com/datasheets/2095614.pdf?src-supplier=Element14; Supplier Part Number 1: 80-A759EQ475M2AAE160
C40 = 0603 Capacitor: C1592; Created By: NourAldin; DataSheet Link: https://eu.mouser.com/datasheet/2/400/lcc_automotive_general_en-843974.pdf; Mouser Link: https://eu.mouser.com/ProductDetail/TDK/CGA1A2X7R1H331M030BA?qs=sGAEpiMZZMs0AnBnWHyRQL8L3bkL%252bvtyS9XpSB1mk7rVV5K8%252bbxEeg%3d%3d
LED3 = 1206 LED: C434438; Created By: NourAldin
Q2 = BSS138_MOSFET: as Q1 on sheet Stepper Motor1; Supplier: LCSC; Supplier Part: C400505; JLCPCB Part Class: Extended Part; spicePre: Q; spiceSymbolName: BSS138_C400505
R22 = 0603 Resistor: C114669; Created By: NourAldin; Mouser Link: https://eu.mouser.com/ProductDetail/Panasonic/ERA-3AHD180V?qs=sGAEpiMZZMvdGkrng054t5mej2KPdPuFSlDBd1tSiF0%3d; DataSheet Link: https://eu.mouser.com/datasheet/2/315/AOA0000C307-1149632.pdf
R23 R24 R26 R30 R34 R36 R38 R40 R41 = 0402 Resistor: C105871
R25 = 0603 Resistor: C2930081; Created By: NourAldin; Mouser Link: https://eu.mouser.com/ProductDetail/Panasonic/ERA-3AHD180V?qs=sGAEpiMZZMvdGkrng054t5mej2KPdPuFSlDBd1tSiF0%3d; DataSheet Link: https://eu.mouser.com/datasheet/2/315/AOA0000C307-1149632.pdf
R27 R28 = 0603 Resistor: C126359; Created By: NourAldin; Mouser Link: https://eu.mouser.com/ProductDetail/Panasonic/ERA-3AHD180V?qs=sGAEpiMZZMvdGkrng054t5mej2KPdPuFSlDBd1tSiF0%3d; DataSheet Link: https://eu.mouser.com/datasheet/2/315/AOA0000C307-1149632.pdf
R29 = 0603 Resistor: C100044; Created By: NourAldin; Mouser Link: https://eu.mouser.com/ProductDetail/Panasonic/ERA-3AHD180V?qs=sGAEpiMZZMvdGkrng054t5mej2KPdPuFSlDBd1tSiF0%3d; DataSheet Link: https://eu.mouser.com/datasheet/2/315/AOA0000C307-1149632.pdf
R31 = 0402 Resistor: C107230
R32 R33 = 2512 Resistor: C2903473; Created By: NourAldin; Mouser Link: https://eu.mouser.com/ProductDetail/Bourns/CSS2H-2512K-2L00F?qs=sGAEpiMZZMukHu%252bjC5l7YewuupLM8jZrvWs15Y6t0rY%3D&fbclid=IwAR0ZD_uc1Y03YG_KyYG8NxrpBzYgFzVeevvjxrlqtGWJ1HKz-jrYfqlFWCw; DataSheet Link: https://eu.mouser.com/datasheet/2/54/ss2h-2512-1302652.pdf
R35 R37 = 0402 Resistor: C105875
R39 = 0402 Resistor: C106235
SW2 = MST23D19G2: as SW1 on sheet Stepper Motor1; Symbol: MST23D19G2; Device: MST23D19G2; LCSC Part Name: 三档立式贴片 8脚拨动 柄长2.0MM; Supplier Part: C431545; Manufacturer Part: MST23D19G2; Supplier Footprint: SMD; JLCPCB Part Class: Extended Part; Datasheet: https://atta.szlcsc.com/upload/public/pdf/source/20190925/C431545_A88710AC241B275593C257CF6D595AD7.pdf; Supplier: LCSC; Convert to PCB: yes; Actuator Style: -; Mounting Style: Brick nogging; Actuator Color: -; Current Rating (AC): -; Voltage Rating (AC): -; Operating Temperature: -25℃~+70℃
T4-T6 = MMBT3904 Transistor: C108429; Created By: NourAldin
U8 = SN74HC14DR: as U1 on sheet Stepper Motor1; Symbol: SN74HC14DR; Device: SN74HC14DR; LCSC Part Name: 六路施密特触发反相器; Supplier Part: C6820; Manufacturer Part: SN74HC14DR; Supplier Footprint: SOIC-14; JLCPCB Part Class: Extended Part; Datasheet: https://www.ti.com/cn/lit/gpn/sn74hc14; Supplier: LCSC; Convert to PCB: yes; Source Current: 5.2mA; Series: 74HCSeries; Operating Temperature: -40℃~+85℃
U9 = TB6600HG: as U3 on sheet Stepper Motor1; Symbol: TB6600HG; Device: TB6600HG; LCSC Part Name: 4.5A 42V电机驱动芯片; Supplier Part: C66042; Manufacturer Part: TB6600HG; Supplier Footprint: HZIP-25-P-1mm; JLCPCB Part Class: Extended Part; Datasheet: https://atta.szlcsc.com/upload/public/pdf/source/20170511/1494500127812.pdf; Supplier: LCSC; Convert to PCB: yes
U10 = REF3318AIDBZR: as U4 on sheet Stepper Motor1; Symbol: REF3318AIDBZR; Device: REF3318AIDBZR; LCSC Part Name: REF3318AIDBZR; Supplier Part: C115877; Manufacturer Part: REF3318AIDBZR; Supplier Footprint: SOT-23; JLCPCB Part Class: Extended Part; Datasheet: https://www.ti.com/cn/lit/gpn/ref3318; Supplier: LCSC; Convert to PCB: yes; Noise - 10Hz to 10kHz: -; Operating Temperature: -40℃~+125℃@(Ta)
U11 U12 = 6N137S-TA1-L: as U5 on sheet Stepper Motor1; Symbol: 6N137S-TA1; Device: 6N137S-TA1-L; LCSC Part Name: DC输入 1通道; Supplier Part: C92651; Manufacturer Part: 6N137S-TA1-L; Supplier Footprint: SOP-8-2.54mm; JLCPCB Part Class: Extended Part; Datasheet: https://atta.szlcsc.com/upload/public/pdf/source/20191018/C92651_D1F9F6F1F10C7EC7C3739E5ECB700036.pdf; Supplier: LCSC; Convert to PCB: yes; Operating Temperature: -40℃~+85℃
U13 = TLP291(GB-TP,SE(T: C55144; BOM_Manufacturer: TOSHIBA(东芝); BOM_Supplier: LCSC; Manufacturer Part Number: TLP291(GB-TP,SE; Supplier Part Number 2: C55144; BOM_JLCPCB Part Class: Extended Part; LCSC Link: https://www.lcsc.com/product-detail/Optocouplers-Phototransistor-Output_TOSHIBA-TLP291-GB-TP-SE_C55144.html; spiceSymbolName: TLP291(GB-TP,SE(T

## Sheet Stepper Motor3.SchDoc
size A2; SheetNumber: 6; SheetTotal: 7
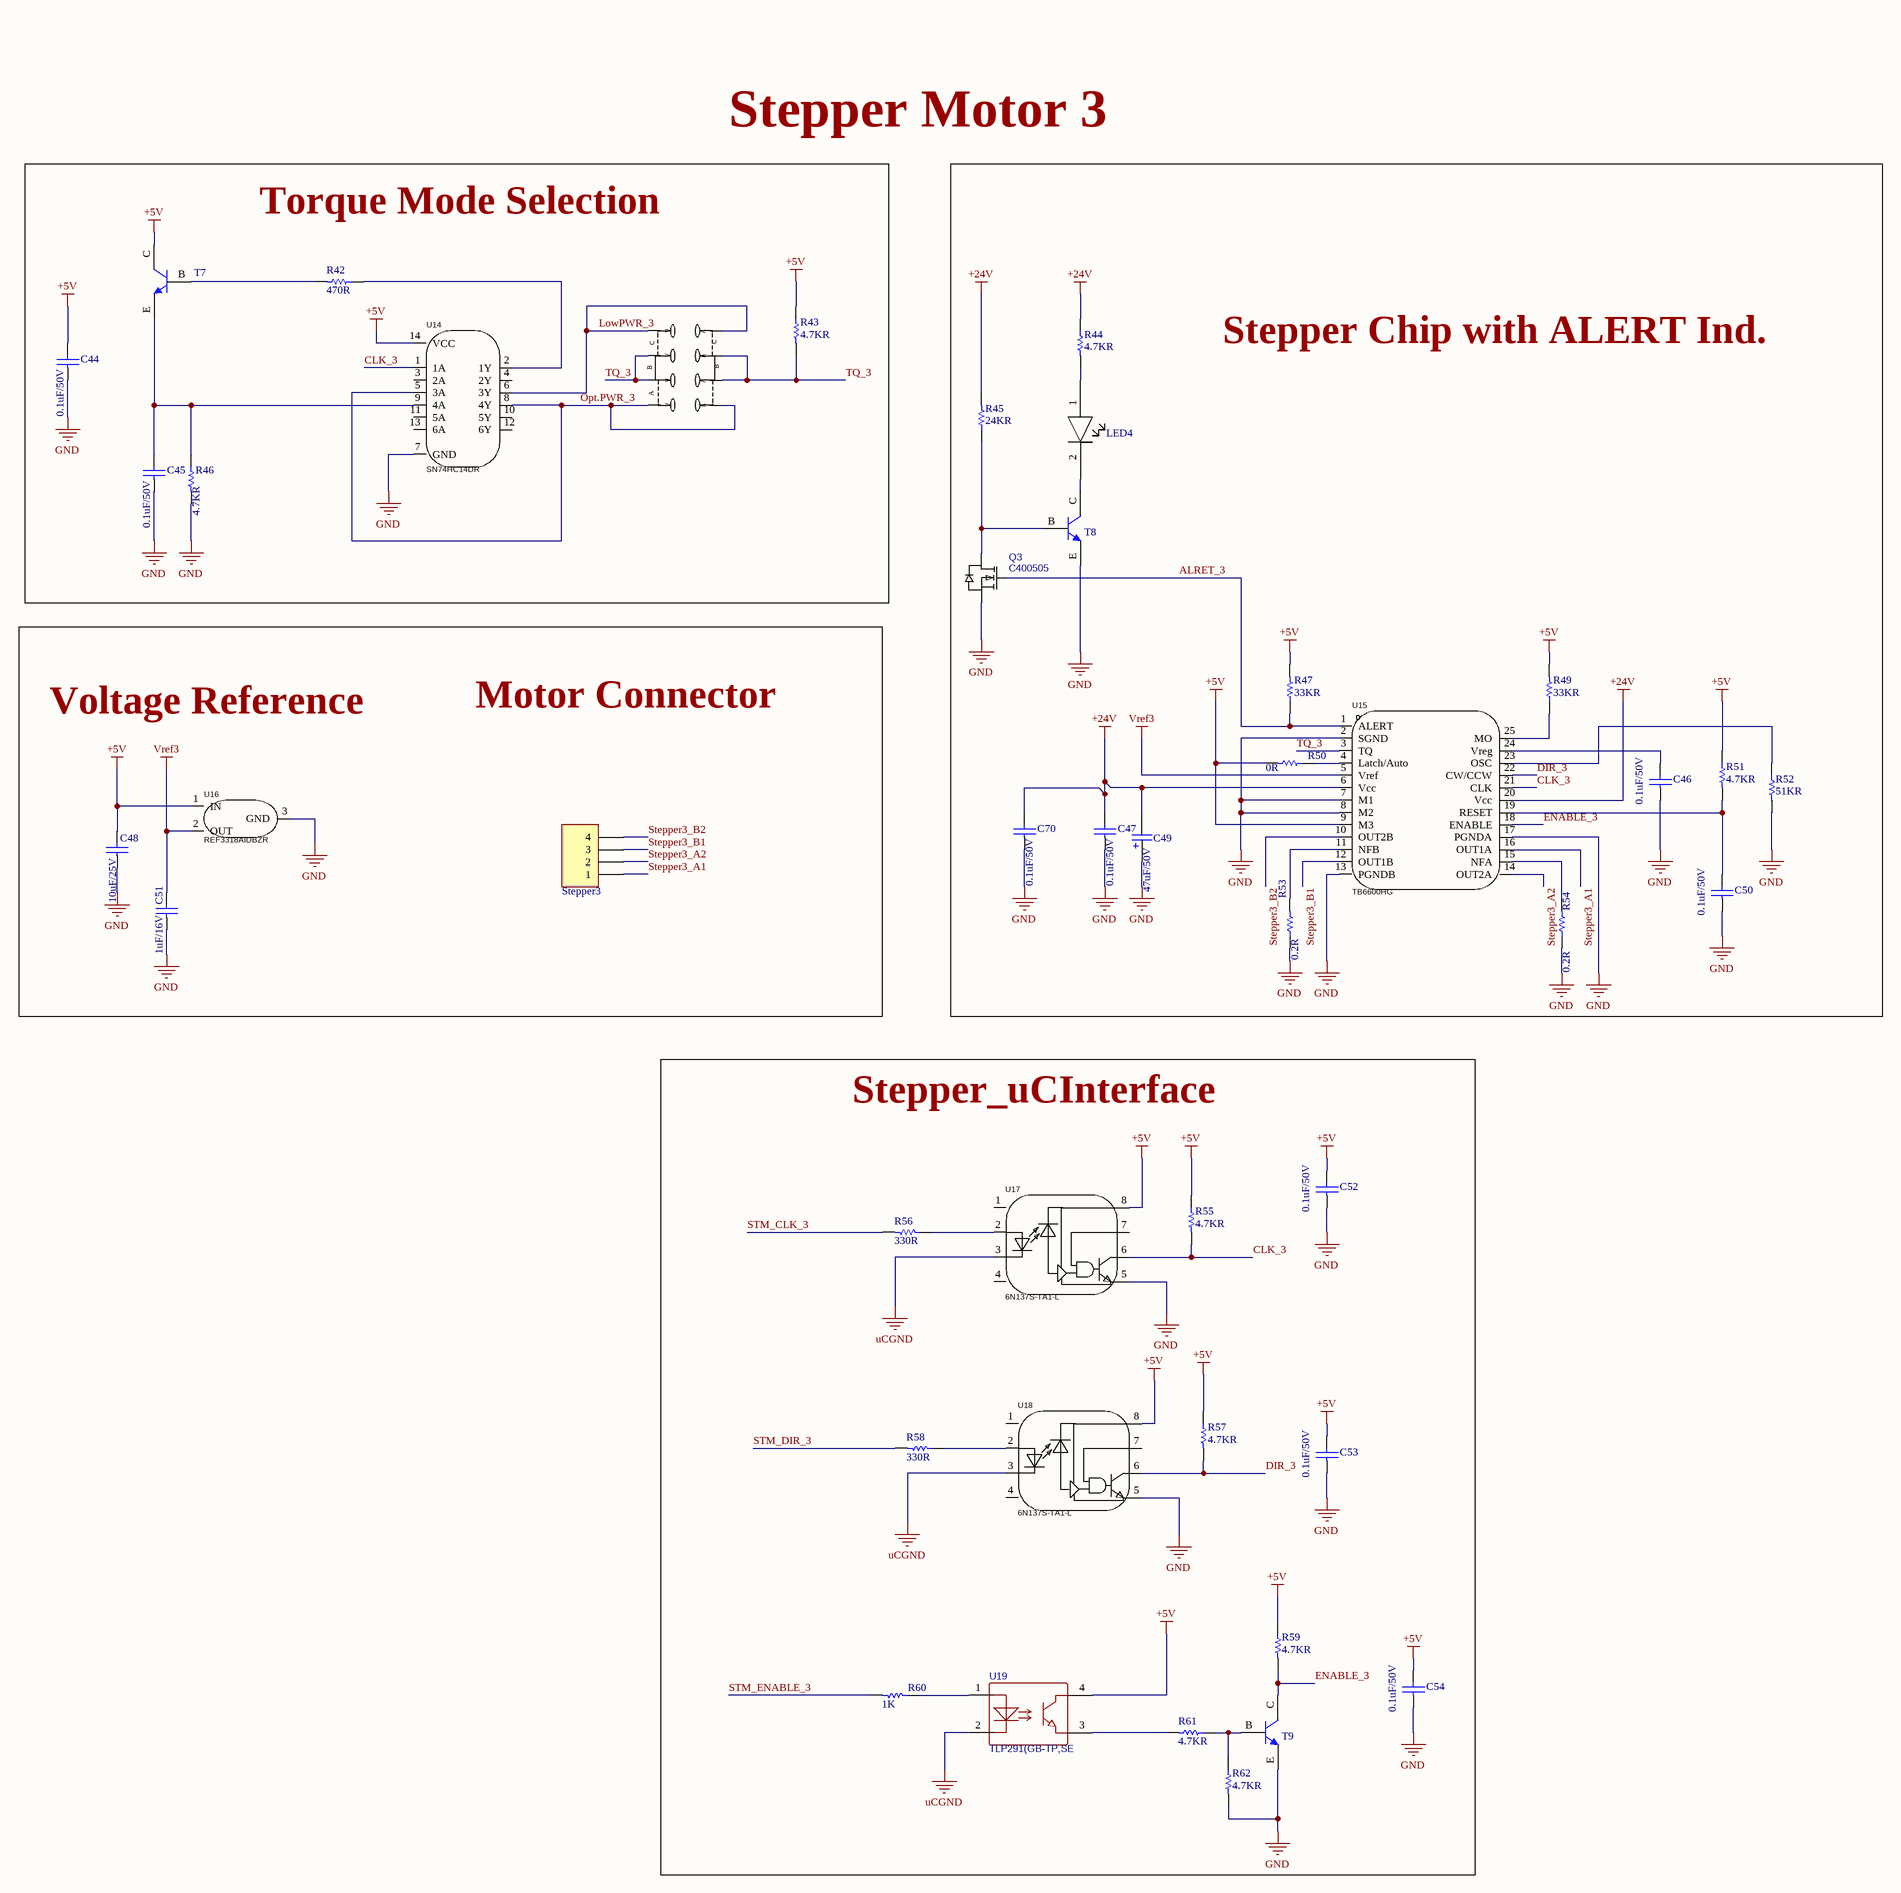
[diagram p4: Stepper Motor3.SchDoc]

### Parts
C44  0.1uF/50V  [PCBComponent_1]
C45  0.1uF/50V  [PCBComponent_1]
C46  0.1uF/50V  [PCBComponent_1]
C47  0.1uF/50V  [PCBComponent_1]
C48  10uF/25V  [PCBComponent_1]
C49  47uF/50V  [CAPLEAD_D6.3mm]  (no BOM)
C50  0.1uF/50V  [PCBComponent_1]
C51  1uF/16V  [PCBComponent_1]
C52  0.1uF/50V  [PCBComponent_1]
C53  0.1uF/50V  [PCBComponent_1]
C54  0.1uF/50V  [PCBComponent_1]
C70  0.1uF/50V  [PCBComponent_1]
LED4  1206 LED  [1206 LED]  (value not drawn)
Q3  C400505  [SOT-23-3_L2.9-W1.3-P1.90-LS2.4-BR]
R42  470R  [RESC1608X06N]
R43  4.7KR  [R0402]
R44  4.7KR  [R0402]
R45  24KR  [RESC1608X06N]
R46  4.7KR  [R0402]
R47  33KR  [RESC1608X06N]
R49  33KR  [RESC1608X06N]
R50  0R  [RESC1608X06N]
R51  4.7KR  [R0402]
R52  51KR  [R0402]
R53  0.2R  [RESC6431X12N]
R54  0.2R  [RESC6431X12N]
R55  4.7KR  [R0402]
R56  330R  [R0402]
R57  4.7KR  [R0402]
R58  330R  [R0402]
R59  4.7KR  [R0402]
R60  1K  [R0402]
R61  4.7KR  [R0402]
R62  4.7KR  [R0402]
Stepper3  Header 4 Pin Polar  [PCBComponent_1]  (value not drawn)  (no BOM)
SW3  MST23D19G2  [SW-SMD_MST23D19G2]  (value not drawn)
T7  MMBT3904 Transistor  [MMBT3904]  (value not drawn)
T8  MMBT3904 Transistor  [MMBT3904]  (value not drawn)
T9  MMBT3904 Transistor  [MMBT3904]  (value not drawn)
U14  SN74HC14DR  [SOIC-14_L8.7-W3.9-P1.27-LS6.0-BL]
U15  TB6600HG  [HZIP25-P-1.00F]  (no BOM)
U16  REF3318AIDBZR  [SOT-23-3_L2.9-W1.3-P1.90-LS2.4-BR]
U17  6N137S-TA1-L  [SOP-8_L9.8-W6.6-P2.54-LS10.3-BL]
U18  6N137S-TA1-L  [SOP-8_L9.8-W6.6-P2.54-LS10.3-BL]
U19  TLP291(GB-TP,SE  [SOP-4-1.27mm]

### Blocks framed on the sheet
Torque Mode Selection: C44 C45 R42 R43 R46 SW3 T7 U14
Stepper Chip with ALERT Ind.: C46 C47 C49 C50 C70 LED4 Q3 R44 R45 R47 R49-R54 T8 U15
Stepper_uCInterface: C52-C54 R55-R62 T9 U17-U19

### Nets
+5V: C44.2 C48.2 C52.2 C53.2 C54.2 R43.1 R47.2 R49.2 R50.2 R51.1 R55.1 R57.1 R59.1 T7.C U14.14(VCC) U15.9(M3) U16.1(IN) U17.8 U18.8 U19.4
+24V: C47.2 C49.2 C70.2 R44.1 R45.2 U15.6(Vcc) U15.20(Vcc)
GND: C44.1 C45.1 C46.1 C47.1 C48.1 C49.1 C50.1 C51.1 C52.1 C53.1 C54.1 C70.1 Q3.2(S) R46.2 R52.2 R53.1 R54.1 R62.2 T8.E T9.E U14.7(GND) U15.2(SGND) U15.7(M1) U15.8(M2) U15.13(PGNDB) U15.17(PGNDA) U16.3(GND) U17.5 U18.5
uCGND: U17.3 U18.3 U19.2
Vref3: C51.2 U15.5(Vref) U16.2(OUT)
ALRET_3: Q3.1(G) R47.1 U15.1(ALERT)
CLK_3: R55.2 U14.1(1A) U15.21(CLK) U17.6
DIR_3: R57.2 U15.22(CW/CCW) U18.6
ENABLE_3: R59.2 T9.C U15.18(ENABLE)
LowPWR_3: SW3.4 SW3.5 U14.6(3Y)
Opt.PWR_3: SW3.1 SW3.8 U14.5(3A) U14.8(4Y)
Stepper3_A1: Stepper3.1 U15.16(OUT1A)
Stepper3_A2: Stepper3.2 U15.14(OUT2A)
Stepper3_B1: Stepper3.3 U15.12(OUT1B)
Stepper3_B2: Stepper3.4 U15.10(OUT2B)
STM_CLK_3: R56.2
STM_DIR_3: R58.2
STM_ENABLE_3: R60.2
TQ_3: R43.2 SW3.2 SW3.3 SW3.6 SW3.7 U15.3(TQ)
NetC45_2: C45.2 R46.1 T7.E U14.9(4A)
NetC46_2: C46.2 U15.24(Vreg)
NetC50_2: C50.2 R51.2 U15.19(RESET)
NetLED4_1: LED4.1 R44.2
NetLED4_2: LED4.2 T8.C
NetQ3_3: Q3.3(D) R45.1 T8.B
NetR42_1: R42.1 U14.2(1Y)
NetR42_2: R42.2 T7.B
NetR49_1: R49.1 U15.25(MO)
NetR50_1: R50.1 U15.4(Latch/Auto)
NetR52_1: R52.1 U15.23(OSC)
NetR53_2: R53.2 U15.11(NFB)
NetR54_2: R54.2 U15.15(NFA)
NetR56_1: R56.1 U17.2
NetR58_1: R58.1 U18.2
NetR60_1: R60.1 U19.1
NetR61_1: R61.1 R62.1 T9.B
NetR61_2: R61.2 U19.3

Not connected (* = marked no-connect by the designer): U14 3(2A) 4(2Y) 10(5Y) 11(5A) 12(6Y) 13(6A); U17 1(NC) 4(NC) 7; U18 1(NC) 4(NC) 7

### Notes on the sheet
- Stepper Motor 3
- Voltage Reference
- Motor Connector
- (in symbol MST23D19G2) C; B; A

### Library data of the parts
C44-C47 C50 C52-C54 C70 = 0603 Capacitor: C1591; Created By: NourAldin; DataSheet Link: https://eu.mouser.com/datasheet/2/400/lcc_automotive_general_en-843974.pdf; Mouser Link: https://eu.mouser.com/ProductDetail/TDK/CGA1A2X7R1H331M030BA?qs=sGAEpiMZZMs0AnBnWHyRQL8L3bkL%252bvtyS9XpSB1mk7rVV5K8%252bbxEeg%3d%3d
C48 = 0603 Capacitor: C96446; Created By: NourAldin; DataSheet Link: https://eu.mouser.com/datasheet/2/400/lcc_automotive_general_en-843974.pdf; Mouser Link: https://eu.mouser.com/ProductDetail/TDK/CGA1A2X7R1H331M030BA?qs=sGAEpiMZZMs0AnBnWHyRQL8L3bkL%252bvtyS9XpSB1mk7rVV5K8%252bbxEeg%3d%3d
C49 = A759EQ475M2AAAE160: C45100; Manufacturer: KEMET; Supplier 1: Mouser; Manufacturer Part Number: A759EQ475M2AAAE160; RoHS: Yes; Category: Polymer Capacitors; Stock 1: 17219; Pricing 1: 1=0.97, 10=0.73, 50=0.73, 100=0.546, 1000=0.384, 10000=0.326 (USD); ComponentLink1URL: http://www.kemet.com/docfinder?Partnumber=A759EQ475M2AAAE160&src-supplier=Digikey; ComponentLink1Description: http://www.kemet.com/docfinder?Partnumber=A759EQ475M2AAAE160&src-supplier=Digikey; ComponentLink2URL: http://www.farnell.com/datasheets/2095614.pdf?src-supplier=Element14; ComponentLink2Description: http://www.farnell.com/datasheets/2095614.pdf?src-supplier=Element14; Supplier Part Number 1: 80-A759EQ475M2AAE160
C51 = 0603 Capacitor: C1592; Created By: NourAldin; DataSheet Link: https://eu.mouser.com/datasheet/2/400/lcc_automotive_general_en-843974.pdf; Mouser Link: https://eu.mouser.com/ProductDetail/TDK/CGA1A2X7R1H331M030BA?qs=sGAEpiMZZMs0AnBnWHyRQL8L3bkL%252bvtyS9XpSB1mk7rVV5K8%252bbxEeg%3d%3d
LED4 = 1206 LED: C434438; Created By: NourAldin
Q3 = BSS138_MOSFET: as Q1 on sheet Stepper Motor1; Supplier: LCSC; Supplier Part: C400505; JLCPCB Part Class: Extended Part; spicePre: Q; spiceSymbolName: BSS138_C400505
R42 = 0603 Resistor: C114669; Created By: NourAldin; Mouser Link: https://eu.mouser.com/ProductDetail/Panasonic/ERA-3AHD180V?qs=sGAEpiMZZMvdGkrng054t5mej2KPdPuFSlDBd1tSiF0%3d; DataSheet Link: https://eu.mouser.com/datasheet/2/315/AOA0000C307-1149632.pdf
R43 R44 R46 R51 R55 R57 R59 R61 R62 = 0402 Resistor: C105871
R45 = 0603 Resistor: C2930081; Created By: NourAldin; Mouser Link: https://eu.mouser.com/ProductDetail/Panasonic/ERA-3AHD180V?qs=sGAEpiMZZMvdGkrng054t5mej2KPdPuFSlDBd1tSiF0%3d; DataSheet Link: https://eu.mouser.com/datasheet/2/315/AOA0000C307-1149632.pdf
R47 R49 = 0603 Resistor: C126359; Created By: NourAldin; Mouser Link: https://eu.mouser.com/ProductDetail/Panasonic/ERA-3AHD180V?qs=sGAEpiMZZMvdGkrng054t5mej2KPdPuFSlDBd1tSiF0%3d; DataSheet Link: https://eu.mouser.com/datasheet/2/315/AOA0000C307-1149632.pdf
R50 = 0603 Resistor: C100044; Created By: NourAldin; Mouser Link: https://eu.mouser.com/ProductDetail/Panasonic/ERA-3AHD180V?qs=sGAEpiMZZMvdGkrng054t5mej2KPdPuFSlDBd1tSiF0%3d; DataSheet Link: https://eu.mouser.com/datasheet/2/315/AOA0000C307-1149632.pdf
R52 = 0402 Resistor: C107230
R53 R54 = 2512 Resistor: C2903473; Created By: NourAldin; Mouser Link: https://eu.mouser.com/ProductDetail/Bourns/CSS2H-2512K-2L00F?qs=sGAEpiMZZMukHu%252bjC5l7YewuupLM8jZrvWs15Y6t0rY%3D&fbclid=IwAR0ZD_uc1Y03YG_KyYG8NxrpBzYgFzVeevvjxrlqtGWJ1HKz-jrYfqlFWCw; DataSheet Link: https://eu.mouser.com/datasheet/2/54/ss2h-2512-1302652.pdf
R56 R58 = 0402 Resistor: C105875
R60 = 0402 Resistor: C106235
SW3 = MST23D19G2: as SW1 on sheet Stepper Motor1; Symbol: MST23D19G2; Device: MST23D19G2; LCSC Part Name: 三档立式贴片 8脚拨动 柄长2.0MM; Supplier Part: C431545; Manufacturer Part: MST23D19G2; Supplier Footprint: SMD; JLCPCB Part Class: Extended Part; Datasheet: https://atta.szlcsc.com/upload/public/pdf/source/20190925/C431545_A88710AC241B275593C257CF6D595AD7.pdf; Supplier: LCSC; Convert to PCB: yes; Actuator Style: -; Mounting Style: Brick nogging; Actuator Color: -; Current Rating (AC): -; Voltage Rating (AC): -; Operating Temperature: -25℃~+70℃
T7-T9 = MMBT3904 Transistor: C108429; Created By: NourAldin
U14 = SN74HC14DR: as U1 on sheet Stepper Motor1; Symbol: SN74HC14DR; Device: SN74HC14DR; LCSC Part Name: 六路施密特触发反相器; Supplier Part: C6820; Manufacturer Part: SN74HC14DR; Supplier Footprint: SOIC-14; JLCPCB Part Class: Extended Part; Datasheet: https://www.ti.com/cn/lit/gpn/sn74hc14; Supplier: LCSC; Convert to PCB: yes; Source Current: 5.2mA; Series: 74HCSeries; Operating Temperature: -40℃~+85℃
U15 = TB6600HG: as U3 on sheet Stepper Motor1; Symbol: TB6600HG; Device: TB6600HG; LCSC Part Name: 4.5A 42V电机驱动芯片; Supplier Part: C66042; Manufacturer Part: TB6600HG; Supplier Footprint: HZIP-25-P-1mm; JLCPCB Part Class: Extended Part; Datasheet: https://atta.szlcsc.com/upload/public/pdf/source/20170511/1494500127812.pdf; Supplier: LCSC; Convert to PCB: yes
U16 = REF3318AIDBZR: as U4 on sheet Stepper Motor1; Symbol: REF3318AIDBZR; Device: REF3318AIDBZR; LCSC Part Name: REF3318AIDBZR; Supplier Part: C115877; Manufacturer Part: REF3318AIDBZR; Supplier Footprint: SOT-23; JLCPCB Part Class: Extended Part; Datasheet: https://www.ti.com/cn/lit/gpn/ref3318; Supplier: LCSC; Convert to PCB: yes; Noise - 10Hz to 10kHz: -; Operating Temperature: -40℃~+125℃@(Ta)
U17 U18 = 6N137S-TA1-L: as U5 on sheet Stepper Motor1; Symbol: 6N137S-TA1; Device: 6N137S-TA1-L; LCSC Part Name: DC输入 1通道; Supplier Part: C92651; Manufacturer Part: 6N137S-TA1-L; Supplier Footprint: SOP-8-2.54mm; JLCPCB Part Class: Extended Part; Datasheet: https://atta.szlcsc.com/upload/public/pdf/source/20191018/C92651_D1F9F6F1F10C7EC7C3739E5ECB700036.pdf; Supplier: LCSC; Convert to PCB: yes; Operating Temperature: -40℃~+85℃
U19 = TLP291(GB-TP,SE(T: C55144; BOM_Manufacturer: TOSHIBA(东芝); BOM_Supplier: LCSC; Manufacturer Part Number: TLP291(GB-TP,SE; Supplier Part Number 2: C55144; BOM_JLCPCB Part Class: Extended Part; LCSC Link: https://www.lcsc.com/product-detail/Optocouplers-Phototransistor-Output_TOSHIBA-TLP291-GB-TP-SE_C55144.html; spiceSymbolName: TLP291(GB-TP,SE(T